# Altium project iso_simucam.PrjPCB (part 1 of 2)
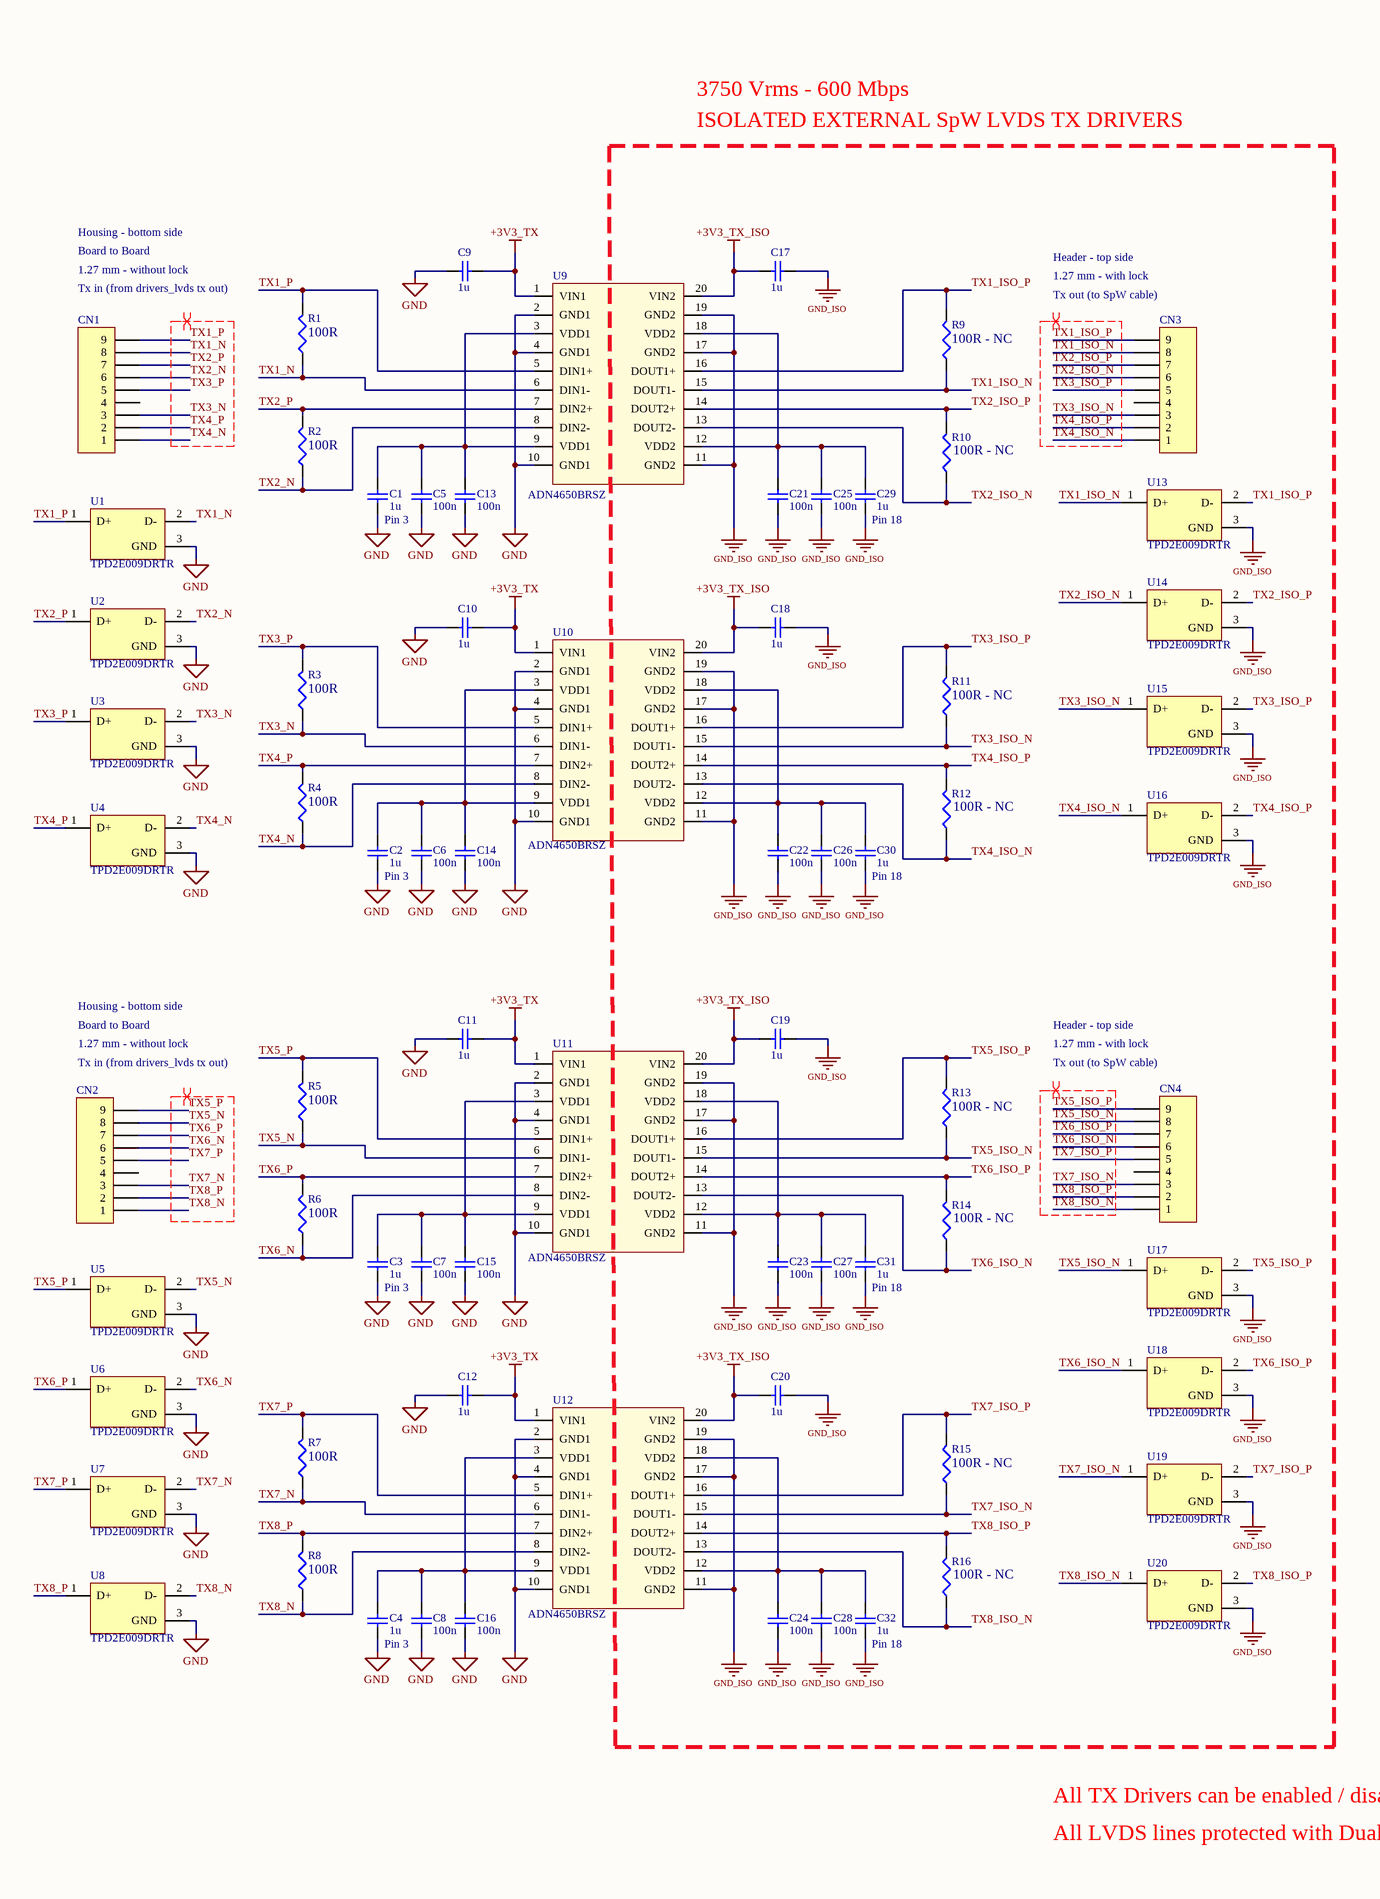
[diagram p0: iso_lvds_tx.SchDoc, left]
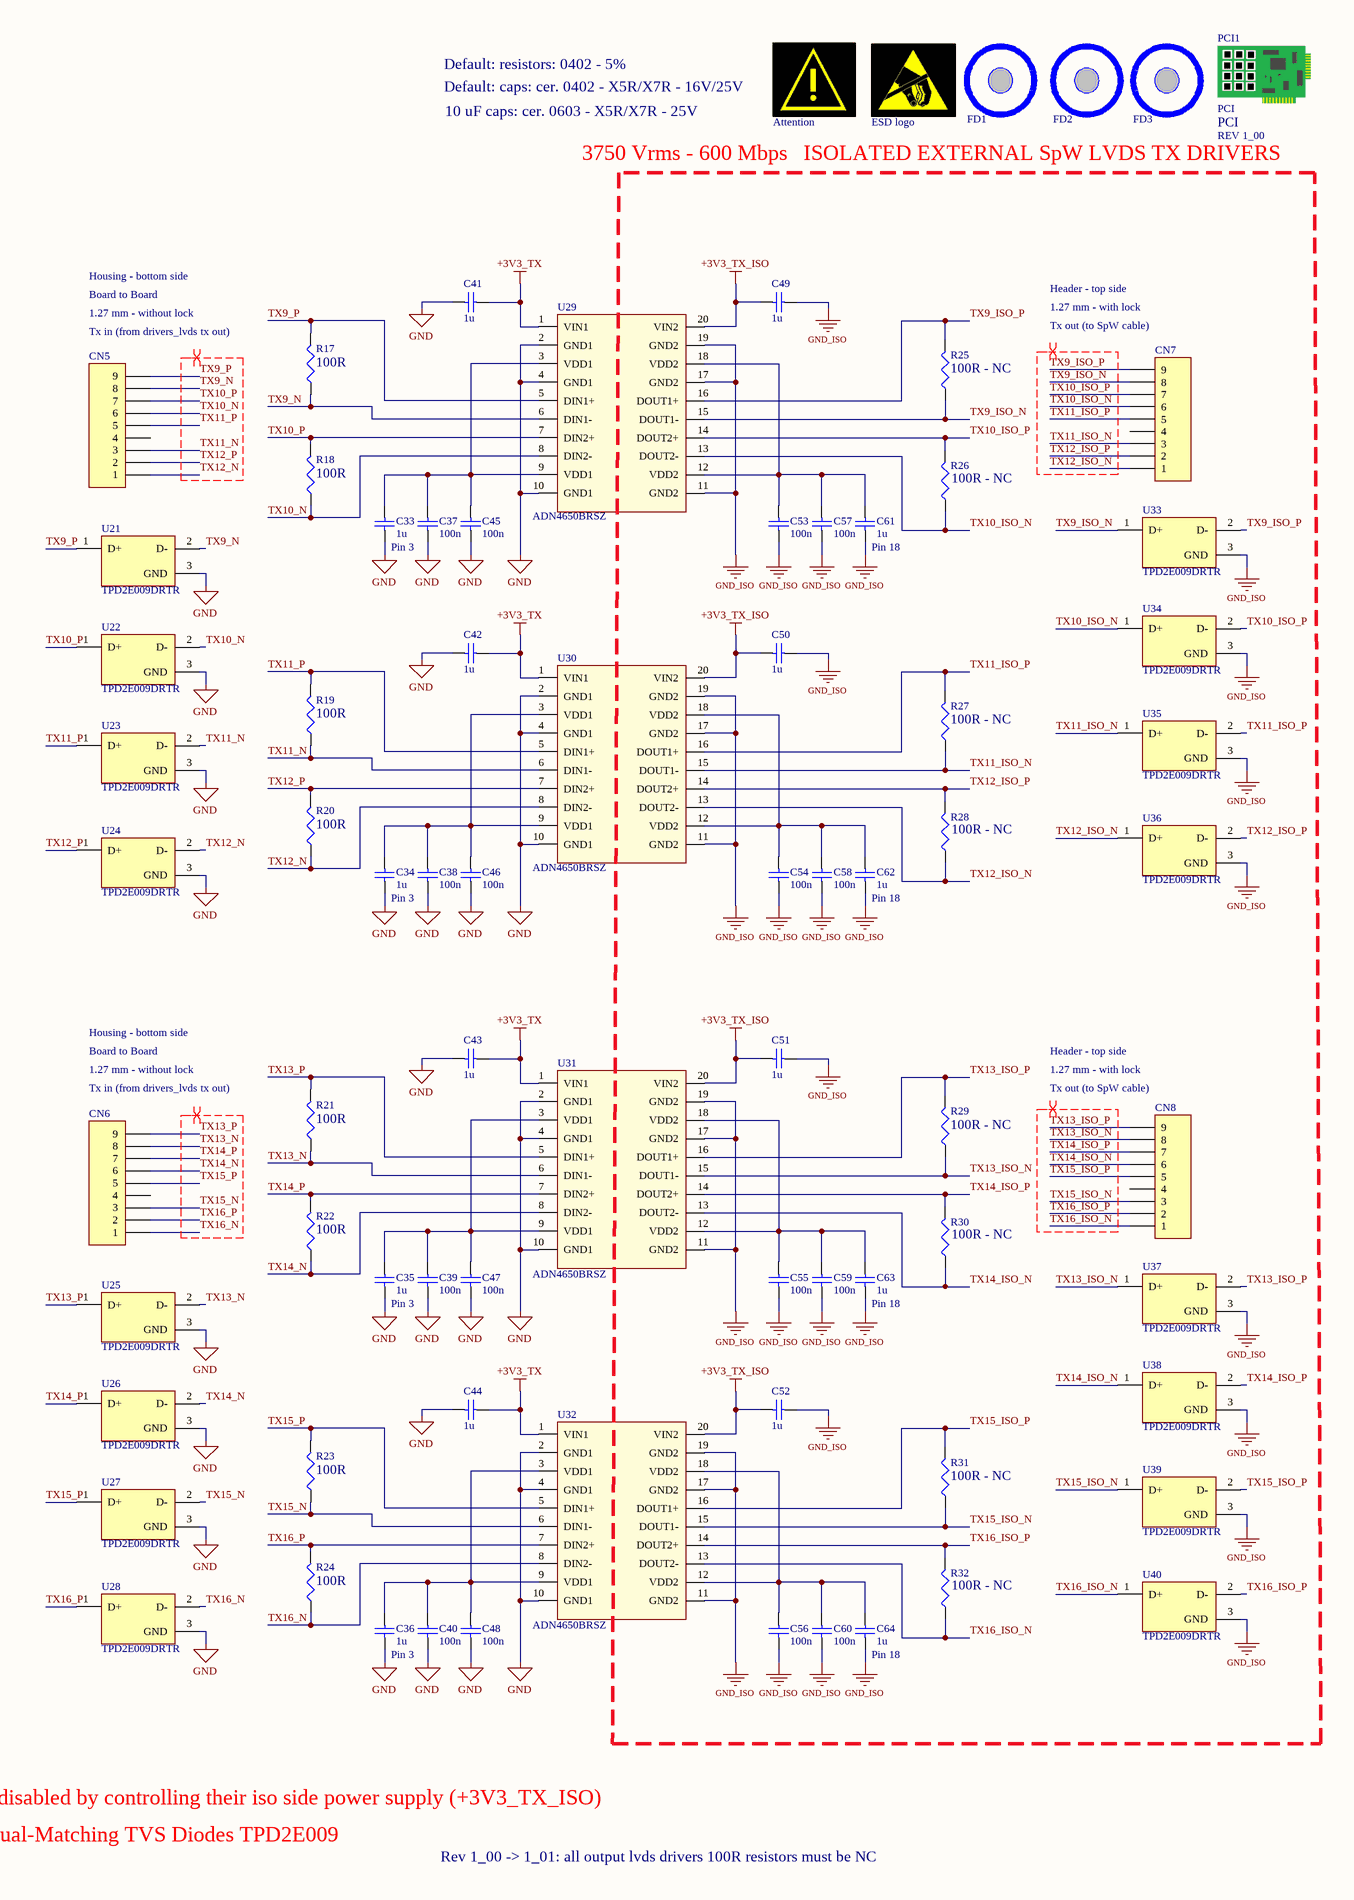
[diagram p1: iso_lvds_tx.SchDoc, right]
4 sheets, 383 parts. Net scope: flat (ports and power ports of the same name join across sheets).
Board file: iso_simucam.PcbDoc
Sheets:
  iso_lvds_tx.SchDoc
  iso_lvds_rx.SchDoc
  iso_sincs.SchDoc
  iso_power.SchDoc

## Sheet iso_lvds_tx.SchDoc: Tx iso drivers
size A2; Author: Cassio Berni; DrawnBy: CCB; Revision: 1_01; SheetNumber: 1; SheetTotal: 4; PageSetup: Record=PageOptions|CenterHorizontal=True|CenterVertical=True|PrintScale=0.50|XCorrection=1.00|YCorrection=1.00|PrintKind=0|BorderSize=5000000|LeftOffset=0|BottomOffset=0|Orientation=2|PaperLength=1000|PaperWidth=1000|Scale=100|PaperSource=7|PrintQuality=-3|MediaType=1|DitherType=10|PrintScaleMode=1|PaperKind=A4|PaperIndex=9

### Parts
AT1  Valor: Attention  [LEIA_DOCUMENTACAO]  (hidden comment: ##nl)
C1  Valor: 1u  [0402-cap]  (hidden comment: Capacitor Cerâmico SMD)
C2  Valor: 1u  [0402-cap]  (hidden comment: Capacitor Cerâmico SMD)
C3  Valor: 1u  [0402-cap]  (hidden comment: Capacitor Cerâmico SMD)
C4  Valor: 1u  [0402-cap]  (hidden comment: Capacitor Cerâmico SMD)
C5  Valor: 100n  [0402-cap]  (hidden comment: Capacitor Cerâmico SMD)
C6  Valor: 100n  [0402-cap]  (hidden comment: Capacitor Cerâmico SMD)
C7  Valor: 100n  [0402-cap]  (hidden comment: Capacitor Cerâmico SMD)
C8  Valor: 100n  [0402-cap]  (hidden comment: Capacitor Cerâmico SMD)
C9  Valor: 1u  [0402-cap]  (hidden comment: Capacitor Cerâmico SMD)
C10  Valor: 1u  [0402-cap]  (hidden comment: Capacitor Cerâmico SMD)
C11  Valor: 1u  [0402-cap]  (hidden comment: Capacitor Cerâmico SMD)
C12  Valor: 1u  [0402-cap]  (hidden comment: Capacitor Cerâmico SMD)
C13  Valor: 100n  [0402-cap]  (hidden comment: Capacitor Cerâmico SMD)
C14  Valor: 100n  [0402-cap]  (hidden comment: Capacitor Cerâmico SMD)
C15  Valor: 100n  [0402-cap]  (hidden comment: Capacitor Cerâmico SMD)
C16  Valor: 100n  [0402-cap]  (hidden comment: Capacitor Cerâmico SMD)
C17  Valor: 1u  [0402-cap]  (hidden comment: Capacitor Cerâmico SMD)
C18  Valor: 1u  [0402-cap]  (hidden comment: Capacitor Cerâmico SMD)
C19  Valor: 1u  [0402-cap]  (hidden comment: Capacitor Cerâmico SMD)
C20  Valor: 1u  [0402-cap]  (hidden comment: Capacitor Cerâmico SMD)
C21  Valor: 100n  [0402-cap]  (hidden comment: Capacitor Cerâmico SMD)
C22  Valor: 100n  [0402-cap]  (hidden comment: Capacitor Cerâmico SMD)
C23  Valor: 100n  [0402-cap]  (hidden comment: Capacitor Cerâmico SMD)
C24  Valor: 100n  [0402-cap]  (hidden comment: Capacitor Cerâmico SMD)
C25  Valor: 100n  [0402-cap]  (hidden comment: Capacitor Cerâmico SMD)
C26  Valor: 100n  [0402-cap]  (hidden comment: Capacitor Cerâmico SMD)
C27  Valor: 100n  [0402-cap]  (hidden comment: Capacitor Cerâmico SMD)
C28  Valor: 100n  [0402-cap]  (hidden comment: Capacitor Cerâmico SMD)
C29  Valor: 1u  [0402-cap]  (hidden comment: Capacitor Cerâmico SMD)
C30  Valor: 1u  [0402-cap]  (hidden comment: Capacitor Cerâmico SMD)
C31  Valor: 1u  [0402-cap]  (hidden comment: Capacitor Cerâmico SMD)
C32  Valor: 1u  [0402-cap]  (hidden comment: Capacitor Cerâmico SMD)
C33  Valor: 1u  [0402-cap]  (hidden comment: Capacitor Cerâmico SMD)
C34  Valor: 1u  [0402-cap]  (hidden comment: Capacitor Cerâmico SMD)
C35  Valor: 1u  [0402-cap]  (hidden comment: Capacitor Cerâmico SMD)
C36  Valor: 1u  [0402-cap]  (hidden comment: Capacitor Cerâmico SMD)
C37  Valor: 100n  [0402-cap]  (hidden comment: Capacitor Cerâmico SMD)
C38  Valor: 100n  [0402-cap]  (hidden comment: Capacitor Cerâmico SMD)
C39  Valor: 100n  [0402-cap]  (hidden comment: Capacitor Cerâmico SMD)
C40  Valor: 100n  [0402-cap]  (hidden comment: Capacitor Cerâmico SMD)
C41  Valor: 1u  [0402-cap]  (hidden comment: Capacitor Cerâmico SMD)
C42  Valor: 1u  [0402-cap]  (hidden comment: Capacitor Cerâmico SMD)
C43  Valor: 1u  [0402-cap]  (hidden comment: Capacitor Cerâmico SMD)
C44  Valor: 1u  [0402-cap]  (hidden comment: Capacitor Cerâmico SMD)
C45  Valor: 100n  [0402-cap]  (hidden comment: Capacitor Cerâmico SMD)
C46  Valor: 100n  [0402-cap]  (hidden comment: Capacitor Cerâmico SMD)
C47  Valor: 100n  [0402-cap]  (hidden comment: Capacitor Cerâmico SMD)
C48  Valor: 100n  [0402-cap]  (hidden comment: Capacitor Cerâmico SMD)
C49  Valor: 1u  [0402-cap]  (hidden comment: Capacitor Cerâmico SMD)
C50  Valor: 1u  [0402-cap]  (hidden comment: Capacitor Cerâmico SMD)
C51  Valor: 1u  [0402-cap]  (hidden comment: Capacitor Cerâmico SMD)
C52  Valor: 1u  [0402-cap]  (hidden comment: Capacitor Cerâmico SMD)
C53  Valor: 100n  [0402-cap]  (hidden comment: Capacitor Cerâmico SMD)
C54  Valor: 100n  [0402-cap]  (hidden comment: Capacitor Cerâmico SMD)
C55  Valor: 100n  [0402-cap]  (hidden comment: Capacitor Cerâmico SMD)
C56  Valor: 100n  [0402-cap]  (hidden comment: Capacitor Cerâmico SMD)
C57  Valor: 100n  [0402-cap]  (hidden comment: Capacitor Cerâmico SMD)
C58  Valor: 100n  [0402-cap]  (hidden comment: Capacitor Cerâmico SMD)
C59  Valor: 100n  [0402-cap]  (hidden comment: Capacitor Cerâmico SMD)
C60  Valor: 100n  [0402-cap]  (hidden comment: Capacitor Cerâmico SMD)
C61  Valor: 1u  [0402-cap]  (hidden comment: Capacitor Cerâmico SMD)
C62  Valor: 1u  [0402-cap]  (hidden comment: Capacitor Cerâmico SMD)
C63  Valor: 1u  [0402-cap]  (hidden comment: Capacitor Cerâmico SMD)
C64  Valor: 1u  [0402-cap]  (hidden comment: Capacitor Cerâmico SMD)
CN1  MHDR1X9  [MHDR1X9_Axonn]  (value not drawn)
CN2  MHDR1X9  [MHDR1X9_Axonn]  (value not drawn)
CN3  MHDR1X9  [MHDR1X9_Axonn]  (value not drawn)
CN4  MHDR1X9  [MHDR1X9_Axonn]  (value not drawn)
CN5  MHDR1X9  [MHDR1X9_Axonn]  (value not drawn)
CN6  MHDR1X9  [MHDR1X9_Axonn]  (value not drawn)
CN7  MHDR1X9  [MHDR1X9_Axonn]  (value not drawn)
CN8  MHDR1X9  [MHDR1X9_Axonn]  (value not drawn)
ESD1  Valor: ESD logo  [ESTATICA]  (hidden comment: ##nl)
FD1  ##nl  [FIDUCIAL]  (value not drawn)
FD2  ##nl  [FIDUCIAL]  (value not drawn)
FD3  ##nl  [FIDUCIAL]  (value not drawn)
PCI1  PCI  Rev: REV 1_00
R1  Valor: 100R  [0402-res]  (hidden comment: Res3)
R2  Valor: 100R  [0402-res]  (hidden comment: Res3)
R3  Valor: 100R  [0402-res]  (hidden comment: Res3)
R4  Valor: 100R  [0402-res]  (hidden comment: Res3)
R5  Valor: 100R  [0402-res]  (hidden comment: Res3)
R6  Valor: 100R  [0402-res]  (hidden comment: Res3)
R7  Valor: 100R  [0402-res]  (hidden comment: Res3)
R8  Valor: 100R  [0402-res]  (hidden comment: Res3)
R9  Valor: 100R - NC  [0402-res]  (hidden comment: Res3)
R10  Valor: 100R - NC  [0402-res]  (hidden comment: Res3)
R11  Valor: 100R - NC  [0402-res]  (hidden comment: Res3)
R12  Valor: 100R - NC  [0402-res]  (hidden comment: Res3)
R13  Valor: 100R - NC  [0402-res]  (hidden comment: Res3)
R14  Valor: 100R - NC  [0402-res]  (hidden comment: Res3)
R15  Valor: 100R - NC  [0402-res]  (hidden comment: Res3)
R16  Valor: 100R - NC  [0402-res]  (hidden comment: Res3)
R17  Valor: 100R  [0402-res]  (hidden comment: Res3)
R18  Valor: 100R  [0402-res]  (hidden comment: Res3)
R19  Valor: 100R  [0402-res]  (hidden comment: Res3)
R20  Valor: 100R  [0402-res]  (hidden comment: Res3)
R21  Valor: 100R  [0402-res]  (hidden comment: Res3)
R22  Valor: 100R  [0402-res]  (hidden comment: Res3)
R23  Valor: 100R  [0402-res]  (hidden comment: Res3)
R24  Valor: 100R  [0402-res]  (hidden comment: Res3)
R25  Valor: 100R - NC  [0402-res]  (hidden comment: Res3)
R26  Valor: 100R - NC  [0402-res]  (hidden comment: Res3)
R27  Valor: 100R - NC  [0402-res]  (hidden comment: Res3)
R28  Valor: 100R - NC  [0402-res]  (hidden comment: Res3)
R29  Valor: 100R - NC  [0402-res]  (hidden comment: Res3)
R30  Valor: 100R - NC  [0402-res]  (hidden comment: Res3)
R31  Valor: 100R - NC  [0402-res]  (hidden comment: Res3)
R32  Valor: 100R - NC  [0402-res]  (hidden comment: Res3)
U1  TPD2E009DRTR  [DRT3]
U2  TPD2E009DRTR  [DRT3]
U3  TPD2E009DRTR  [DRT3]
U4  TPD2E009DRTR  [DRT3]
U5  TPD2E009DRTR  [DRT3]
U6  TPD2E009DRTR  [DRT3]
U7  TPD2E009DRTR  [DRT3]
U8  TPD2E009DRTR  [DRT3]
U9  ADN4650BRSZ  [SSOP-RS-20]
U10  ADN4650BRSZ  [SSOP-RS-20]
U11  ADN4650BRSZ  [SSOP-RS-20]
U12  ADN4650BRSZ  [SSOP-RS-20]
U13  TPD2E009DRTR  [DRT3]
U14  TPD2E009DRTR  [DRT3]
U15  TPD2E009DRTR  [DRT3]
U16  TPD2E009DRTR  [DRT3]
U17  TPD2E009DRTR  [DRT3]
U18  TPD2E009DRTR  [DRT3]
U19  TPD2E009DRTR  [DRT3]
U20  TPD2E009DRTR  [DRT3]
U21  TPD2E009DRTR  [DRT3]
U22  TPD2E009DRTR  [DRT3]
U23  TPD2E009DRTR  [DRT3]
U24  TPD2E009DRTR  [DRT3]
U25  TPD2E009DRTR  [DRT3]
U26  TPD2E009DRTR  [DRT3]
U27  TPD2E009DRTR  [DRT3]
U28  TPD2E009DRTR  [DRT3]
U29  ADN4650BRSZ  [SSOP-RS-20]
U30  ADN4650BRSZ  [SSOP-RS-20]
U31  ADN4650BRSZ  [SSOP-RS-20]
U32  ADN4650BRSZ  [SSOP-RS-20]
U33  TPD2E009DRTR  [DRT3]
U34  TPD2E009DRTR  [DRT3]
U35  TPD2E009DRTR  [DRT3]
U36  TPD2E009DRTR  [DRT3]
U37  TPD2E009DRTR  [DRT3]
U38  TPD2E009DRTR  [DRT3]
U39  TPD2E009DRTR  [DRT3]
U40  TPD2E009DRTR  [DRT3]

### Blocks framed on the sheet
ISOLATED EXTERNAL SpW LVDS TX DRIVERS: C17-C32 CN3 CN4 R9-R16 U9-U20
ISOLATED EXTERNAL SpW LVDS TX DRIVERS: C49-C64 CN7 CN8 R25-R32 U29-U40

### Nets
+3V3_TX: C9.1 C10.1 C11.1 C12.1 C41.1 C42.1 C43.1 C44.1 U9.1(VIN1) U10.1(VIN1) U11.1(VIN1) U12.1(VIN1) U29.1(VIN1) U30.1(VIN1) U31.1(VIN1) U32.1(VIN1)
+3V3_TX_ISO: C17.2 C18.2 C19.2 C20.2 C49.2 C50.2 C51.2 C52.2 U9.20(VIN2) U10.20(VIN2) U11.20(VIN2) U12.20(VIN2) U29.20(VIN2) U30.20(VIN2) U31.20(VIN2) U32.20(VIN2)
GND: C1.1 C2.1 C3.1 C4.1 C5.1 C6.1 C7.1 C8.1 C9.2 C10.2 C11.2 C12.2 C13.1 C14.1 C15.1 C16.1 C33.1 C34.1 C35.1 C36.1 C37.1 C38.1 C39.1 C40.1 C41.2 C42.2 C43.2 C44.2 C45.1 C46.1 C47.1 C48.1 U1.3(GND) U2.3(GND) U3.3(GND) U4.3(GND) U5.3(GND) U6.3(GND) U7.3(GND) U8.3(GND) U9.2(GND1) U9.4(GND1) U9.10(GND1) U10.2(GND1) U10.4(GND1) U10.10(GND1) U11.2(GND1) U11.4(GND1) U11.10(GND1) U12.2(GND1) U12.4(GND1) U12.10(GND1) U21.3(GND) U22.3(GND) U23.3(GND) U24.3(GND) U25.3(GND) U26.3(GND) U27.3(GND) U28.3(GND) U29.2(GND1) U29.4(GND1) U29.10(GND1) U30.2(GND1) U30.4(GND1) U30.10(GND1) U31.2(GND1) U31.4(GND1) U31.10(GND1) U32.2(GND1) U32.4(GND1) U32.10(GND1)
GND_ISO: C17.1 C18.1 C19.1 C20.1 C21.1 C22.1 C23.1 C24.1 C25.1 C26.1 C27.1 C28.1 C29.1 C30.1 C31.1 C32.1 C49.1 C50.1 C51.1 C52.1 C53.1 C54.1 C55.1 C56.1 C57.1 C58.1 C59.1 C60.1 C61.1 C62.1 C63.1 C64.1 U9.11(GND2) U9.17(GND2) U9.19(GND2) U10.11(GND2) U10.17(GND2) U10.19(GND2) U11.11(GND2) U11.17(GND2) U11.19(GND2) U12.11(GND2) U12.17(GND2) U12.19(GND2) U13.3(GND) U14.3(GND) U15.3(GND) U16.3(GND) U17.3(GND) U18.3(GND) U19.3(GND) U20.3(GND) U29.11(GND2) U29.17(GND2) U29.19(GND2) U30.11(GND2) U30.17(GND2) U30.19(GND2) U31.11(GND2) U31.17(GND2) U31.19(GND2) U32.11(GND2) U32.17(GND2) U32.19(GND2) U33.3(GND) U34.3(GND) U35.3(GND) U36.3(GND) U37.3(GND) U38.3(GND) U39.3(GND) U40.3(GND)
TX1_ISO_N: CN3.8 R9.1 U9.15(DOUT1-) U13.1(D+)
TX1_ISO_P: CN3.9 R9.2 U9.16(DOUT1+) U13.2(D-)
TX1_N: CN1.8 R1.1 U1.2(D-) U9.6(DIN1-)
TX1_P: CN1.9 R1.2 U1.1(D+) U9.5(DIN1+)
TX2_ISO_N: CN3.6 R10.1 U9.13(DOUT2-) U14.1(D+)
TX2_ISO_P: CN3.7 R10.2 U9.14(DOUT2+) U14.2(D-)
TX2_N: CN1.6 R2.1 U2.2(D-) U9.8(DIN2-)
TX2_P: CN1.7 R2.2 U2.1(D+) U9.7(DIN2+)
TX3_ISO_N: CN3.3 R11.1 U10.15(DOUT1-) U15.1(D+)
TX3_ISO_P: CN3.5 R11.2 U10.16(DOUT1+) U15.2(D-)
TX3_N: CN1.3 R3.1 U3.2(D-) U10.6(DIN1-)
TX3_P: CN1.5 R3.2 U3.1(D+) U10.5(DIN1+)
TX4_ISO_N: CN3.1 R12.1 U10.13(DOUT2-) U16.1(D+)
TX4_ISO_P: CN3.2 R12.2 U10.14(DOUT2+) U16.2(D-)
TX4_N: CN1.1 R4.1 U4.2(D-) U10.8(DIN2-)
TX4_P: CN1.2 R4.2 U4.1(D+) U10.7(DIN2+)
TX5_ISO_N: CN4.8 R13.1 U11.15(DOUT1-) U17.1(D+)
TX5_ISO_P: CN4.9 R13.2 U11.16(DOUT1+) U17.2(D-)
TX5_N: CN2.8 R5.1 U5.2(D-) U11.6(DIN1-)
TX5_P: CN2.9 R5.2 U5.1(D+) U11.5(DIN1+)
TX6_ISO_N: CN4.6 R14.1 U11.13(DOUT2-) U18.1(D+)
TX6_ISO_P: CN4.7 R14.2 U11.14(DOUT2+) U18.2(D-)
TX6_N: CN2.6 R6.1 U6.2(D-) U11.8(DIN2-)
TX6_P: CN2.7 R6.2 U6.1(D+) U11.7(DIN2+)
TX7_ISO_N: CN4.3 R15.1 U12.15(DOUT1-) U19.1(D+)
TX7_ISO_P: CN4.5 R15.2 U12.16(DOUT1+) U19.2(D-)
TX7_N: CN2.3 R7.1 U7.2(D-) U12.6(DIN1-)
TX7_P: CN2.5 R7.2 U7.1(D+) U12.5(DIN1+)
TX8_ISO_N: CN4.1 R16.1 U12.13(DOUT2-) U20.1(D+)
TX8_ISO_P: CN4.2 R16.2 U12.14(DOUT2+) U20.2(D-)
TX8_N: CN2.1 R8.1 U8.2(D-) U12.8(DIN2-)
TX8_P: CN2.2 R8.2 U8.1(D+) U12.7(DIN2+)
TX9_ISO_N: CN7.8 R25.1 U29.15(DOUT1-) U33.1(D+)
TX9_ISO_P: CN7.9 R25.2 U29.16(DOUT1+) U33.2(D-)
TX9_N: CN5.8 R17.1 U21.2(D-) U29.6(DIN1-)
TX9_P: CN5.9 R17.2 U21.1(D+) U29.5(DIN1+)
TX10_ISO_N: CN7.6 R26.1 U29.13(DOUT2-) U34.1(D+)
TX10_ISO_P: CN7.7 R26.2 U29.14(DOUT2+) U34.2(D-)
TX10_N: CN5.6 R18.1 U22.2(D-) U29.8(DIN2-)
TX10_P: CN5.7 R18.2 U22.1(D+) U29.7(DIN2+)
TX11_ISO_N: CN7.3 R27.1 U30.15(DOUT1-) U35.1(D+)
TX11_ISO_P: CN7.5 R27.2 U30.16(DOUT1+) U35.2(D-)
TX11_N: CN5.3 R19.1 U23.2(D-) U30.6(DIN1-)
TX11_P: CN5.5 R19.2 U23.1(D+) U30.5(DIN1+)
TX12_ISO_N: CN7.1 R28.1 U30.13(DOUT2-) U36.1(D+)
TX12_ISO_P: CN7.2 R28.2 U30.14(DOUT2+) U36.2(D-)
TX12_N: CN5.1 R20.1 U24.2(D-) U30.8(DIN2-)
TX12_P: CN5.2 R20.2 U24.1(D+) U30.7(DIN2+)
TX13_ISO_N: CN8.8 R29.1 U31.15(DOUT1-) U37.1(D+)
TX13_ISO_P: CN8.9 R29.2 U31.16(DOUT1+) U37.2(D-)
TX13_N: CN6.8 R21.1 U25.2(D-) U31.6(DIN1-)
TX13_P: CN6.9 R21.2 U25.1(D+) U31.5(DIN1+)
TX14_ISO_N: CN8.6 R30.1 U31.13(DOUT2-) U38.1(D+)
TX14_ISO_P: CN8.7 R30.2 U31.14(DOUT2+) U38.2(D-)
TX14_N: CN6.6 R22.1 U26.2(D-) U31.8(DIN2-)
TX14_P: CN6.7 R22.2 U26.1(D+) U31.7(DIN2+)
TX15_ISO_N: CN8.3 R31.1 U32.15(DOUT1-) U39.1(D+)
TX15_ISO_P: CN8.5 R31.2 U32.16(DOUT1+) U39.2(D-)
TX15_N: CN6.3 R23.1 U27.2(D-) U32.6(DIN1-)
TX15_P: CN6.5 R23.2 U27.1(D+) U32.5(DIN1+)
TX16_ISO_N: CN8.1 R32.1 U32.13(DOUT2-) U40.1(D+)
TX16_ISO_P: CN8.2 R32.2 U32.14(DOUT2+) U40.2(D-)
TX16_N: CN6.1 R24.1 U28.2(D-) U32.8(DIN2-)
TX16_P: CN6.2 R24.2 U28.1(D+) U32.7(DIN2+)
NetC1_2: C1.2 C5.2 C13.2 U9.3(VDD1) U9.9(VDD1)
NetC2_2: C2.2 C6.2 C14.2 U10.3(VDD1) U10.9(VDD1)
NetC3_2: C3.2 C7.2 C15.2 U11.3(VDD1) U11.9(VDD1)
NetC4_2: C4.2 C8.2 C16.2 U12.3(VDD1) U12.9(VDD1)
NetC21_2: C21.2 C25.2 C29.2 U9.12(VDD2) U9.18(VDD2)
NetC22_2: C22.2 C26.2 C30.2 U10.12(VDD2) U10.18(VDD2)
NetC23_2: C23.2 C27.2 C31.2 U11.12(VDD2) U11.18(VDD2)
NetC24_2: C24.2 C28.2 C32.2 U12.12(VDD2) U12.18(VDD2)
NetC33_2: C33.2 C37.2 C45.2 U29.3(VDD1) U29.9(VDD1)
NetC34_2: C34.2 C38.2 C46.2 U30.3(VDD1) U30.9(VDD1)
NetC35_2: C35.2 C39.2 C47.2 U31.3(VDD1) U31.9(VDD1)
NetC36_2: C36.2 C40.2 C48.2 U32.3(VDD1) U32.9(VDD1)
NetC53_2: C53.2 C57.2 C61.2 U29.12(VDD2) U29.18(VDD2)
NetC54_2: C54.2 C58.2 C62.2 U30.12(VDD2) U30.18(VDD2)
NetC55_2: C55.2 C59.2 C63.2 U31.12(VDD2) U31.18(VDD2)
NetC56_2: C56.2 C60.2 C64.2 U32.12(VDD2) U32.18(VDD2)

Not connected (* = marked no-connect by the designer): CN1 4; CN2 4; CN3 4; CN4 4; CN5 4; CN6 4; CN7 4; CN8 4

### Layout directives
differential pair; net class TX1_TX4; rule Differential Pairs Routing [Pref Gap = 10mil    Min Gap  = 10mil    Max Gap  = 10milPref Width = 10mil    Min Width  = 10mil    Max Width  = 10mil]: TX1_N, TX1_P, TX2_N, TX2_P, TX3_N, TX3_P, TX4_N, TX4_P
differential pair; net class TX5_TX8; rule Differential Pairs Routing [Pref Gap = 10mil    Min Gap  = 10mil    Max Gap  = 10milPref Width = 10mil    Min Width  = 10mil    Max Width  = 10mil]: TX5_N, TX5_P, TX6_N, TX6_P, TX7_N, TX7_P, TX8_N, TX8_P
differential pair; net class TX1_TX4_ISO; rule Differential Pairs Routing [Pref Gap = 10mil    Min Gap  = 10mil    Max Gap  = 10milPref Width = 10mil    Min Width  = 10mil    Max Width  = 10mil]: TX1_ISO_N, TX1_ISO_P, TX2_ISO_N, TX2_ISO_P, TX3_ISO_N, TX3_ISO_P, TX4_ISO_N, TX4_ISO_P
differential pair; net class TX5_TX8_ISO; rule Differential Pairs Routing [Pref Gap = 10mil    Min Gap  = 10mil    Max Gap  = 10milPref Width = 10mil    Min Width  = 10mil    Max Width  = 10mil]: TX5_ISO_N, TX5_ISO_P, TX6_ISO_N, TX6_ISO_P, TX7_ISO_N, TX7_ISO_P, TX8_ISO_N, TX8_ISO_P
differential pair; net class TX9_TX12; rule Differential Pairs Routing [Pref Gap = 10mil    Min Gap  = 10mil    Max Gap  = 10milPref Width = 10mil    Min Width  = 10mil    Max Width  = 10mil]: TX9_N, TX9_P, TX10_N, TX10_P, TX11_N, TX11_P, TX12_N, TX12_P
differential pair; net class TX13_TX16; rule Differential Pairs Routing [Pref Gap = 10mil    Min Gap  = 10mil    Max Gap  = 10milPref Width = 10mil    Min Width  = 10mil    Max Width  = 10mil]: TX13_ISO_N, TX13_ISO_P, TX13_N, TX13_P, TX14_ISO_N, TX14_ISO_P, TX14_N, TX14_P, TX15_ISO_N, TX15_ISO_P, TX15_N, TX15_P, TX16_ISO_N, TX16_ISO_P, TX16_N, TX16_P
differential pair; net class TX9_TX12_ISO; rule Differential Pairs Routing [Pref Gap = 10mil    Min Gap  = 10mil    Max Gap  = 10milPref Width = 10mil    Min Width  = 10mil    Max Width  = 10mil]: TX9_ISO_N, TX9_ISO_P, TX10_ISO_N, TX10_ISO_P, TX11_ISO_N, TX11_ISO_P, TX12_ISO_N, TX12_ISO_P

### Notes on the sheet
- Default: resistors: 0402 - 5%
- (near AT1) Default: caps: cer. 0402 - X5R/X7R - 16V/25V
- 3750 Vrms - 600 Mbps
- 10 uF caps: cer. 0603 - X5R/X7R - 25V
- Housing - bottom side
- Board to Board
- 1.27 mm - without lock
- Tx in (from drivers_lvds tx out)
- Header - top side
- 1.27 mm - with lock
- (near CN3) Tx out (to SpW cable)
- (near CN7) Tx out (to SpW cable)
- Pin 3
- (near C29) Pin 18
- (near C61) Pin 18
- (near C30) Pin 18
- (near C62) Pin 18
- (near CN4) Tx out (to SpW cable)
- (near CN8) Tx out (to SpW cable)
- (near C31) Pin 18
- (near C63) Pin 18
- (near C32) Pin 18
- (near C64) Pin 18
- All TX Drivers can be enabled / disabled by controlling their iso side power supply (+3V3_TX_ISO)
- All LVDS lines protected with Dual-Matching TVS Diodes TPD2E009
- Rev 1_00 -> 1_01: all output lvds drivers 100R resistors must be NC

### Library data of the parts
AT1 = ATENCAO
CN1-CN8 = MHDR1X9: Header, 9-Pin; LatestRevisionDate: 17-Jul-2002; LatestRevisionNote: Re-released for DXP Platform.; Publisher: Altium Limited
ESD1 = ESD
FD1-FD3 = Fiducial: Valor: *
R1-R32 = Res3: Resistor; Grupo: 01
U1-U8 U13-U28 U33-U40 = TPD2E009DRTR: ESD Protection Array for High-Speed Data Interfaces, 2 Channels, -40 to +85 degC, 3-pin SOT (DRT), Green (RoHS & no Sb/Br); Manufacturer: Texas Instruments; Breakdown Voltage(Min)(V): 9; Differential Capacitance(pF): 0.01; IEC 61000-4-2 Air-Gap(+/- kV): 8; IO Capacitance(Typ)(pF): 0.7; IO Leakage Current(nA): 10; Serial ATA / eSATA: TRUE; SubFamily: ESD Solution; DatasheetVersion: SLVS953A; PackageVersion: revD, Jun-2008; PackageReference: DRT3; PackageDescription: 3-Flat Lead Plastic Small Outline, 1 x 1 mm (inc leads), 0.35 mm Pitch; Supplier 1: Digi-Key; Supplier Part Number 1: 296-25410-2-ND; Supplier 2: Digi-Key; Supplier Part Number 2: 296-25410-1-ND; Supplier 3: Digi-Key; Supplier Part Number 3: 296-25410-6-ND; Supplier 4: Newark; Supplier Part Number 4: 50R8093; Supplier 5: Mouser; Supplier Part Number 5: 595-TPD2E009DRTR; Eco-Plan: Green (RoHS & no Sb/Br); IEC 61000-4-2 Contact(+/- kV): 8; Mounting Technology: Surface Mount; PartNumber: TPD2E009DRTR; ComponentLink1Description: Datasheet; ComponentLink1URL: http://www.ti.com/general/docs/lit/getliterature.tsp?genericPartNumber=TPD2E009&fileType=pdf; ComponentLink2Description: URL Link1; ComponentLink2URL: SamplesURL:http://www.ti.com/product/tpd2e009#samples
U9-U12 U29-U32 = ADN4650BRSZ: 5 kV RMS/3.75 kV RMS, 600 Mbps,  Dual-Channel LVDS Isolators; Fabricante: Analog Devices; Grupo: 07; Encapsulamento: SSOP-20; Valor: *; Obs: *; Datasheet: *; Part Number: ADN4650BRSZ
PCI1 = PCI: Valor: PCI

## Sheet iso_lvds_rx.SchDoc: Rx iso drivers
size A2; Author: Cassio Berni; DrawnBy: CCB; Revision: 1_01; SheetNumber: 2; SheetTotal: 4; PageSetup: Record=PageOptions|CenterHorizontal=True|CenterVertical=True|PrintScale=0.50|XCorrection=1.00|YCorrection=1.00|PrintKind=0|BorderSize=5000000|LeftOffset=0|BottomOffset=0|Orientation=2|PaperLength=1000|PaperWidth=1000|Scale=100|PaperSource=7|PrintQuality=-3|MediaType=1|DitherType=10|PrintScaleMode=1|PaperKind=A4|PaperIndex=9
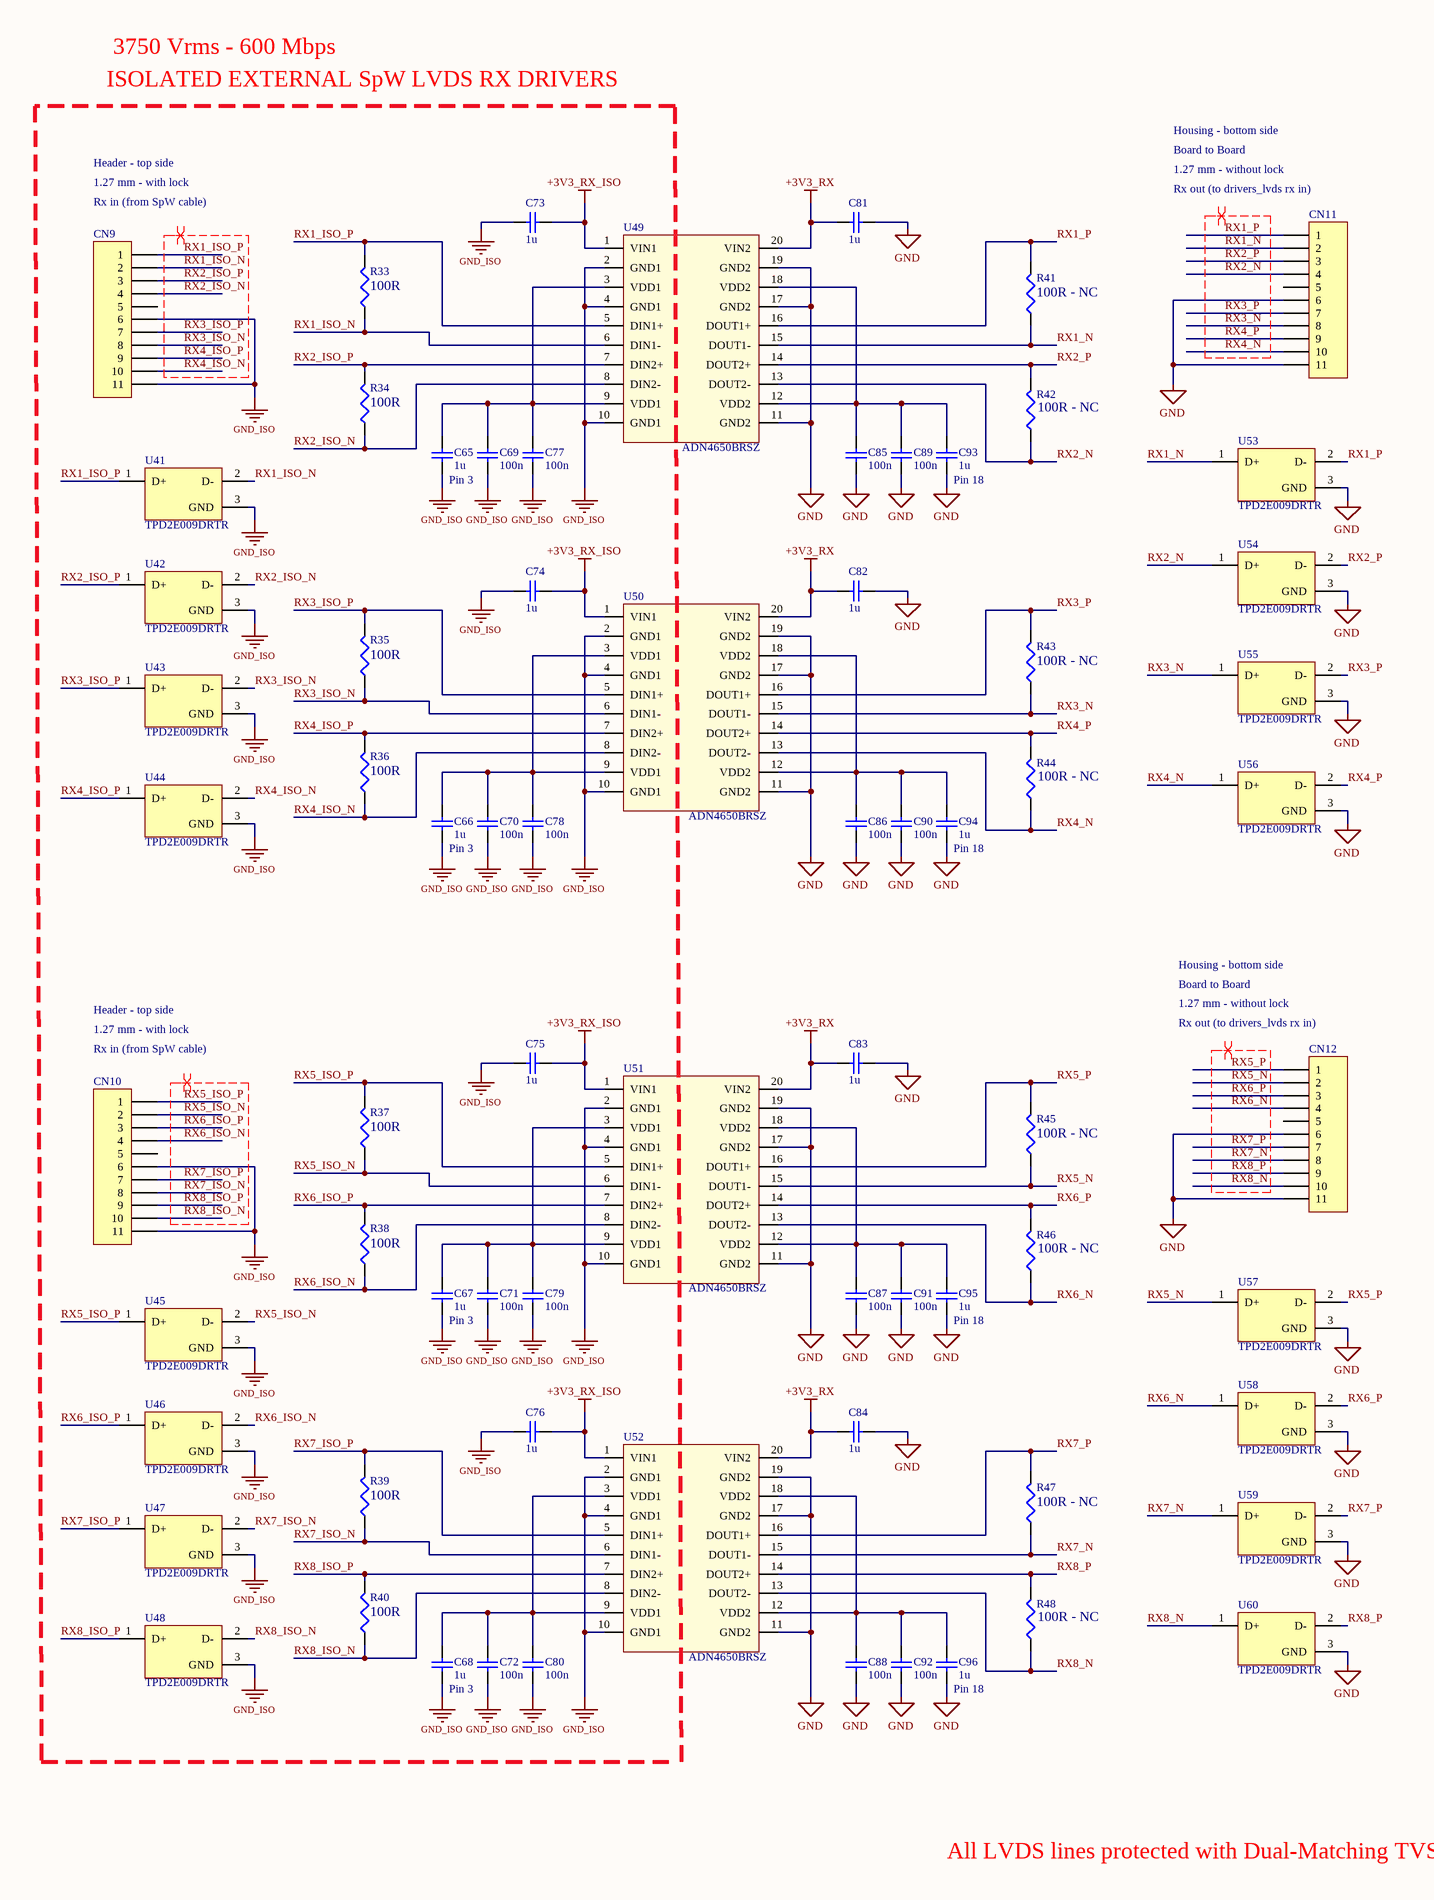
[diagram p2: iso_lvds_rx.SchDoc, left]
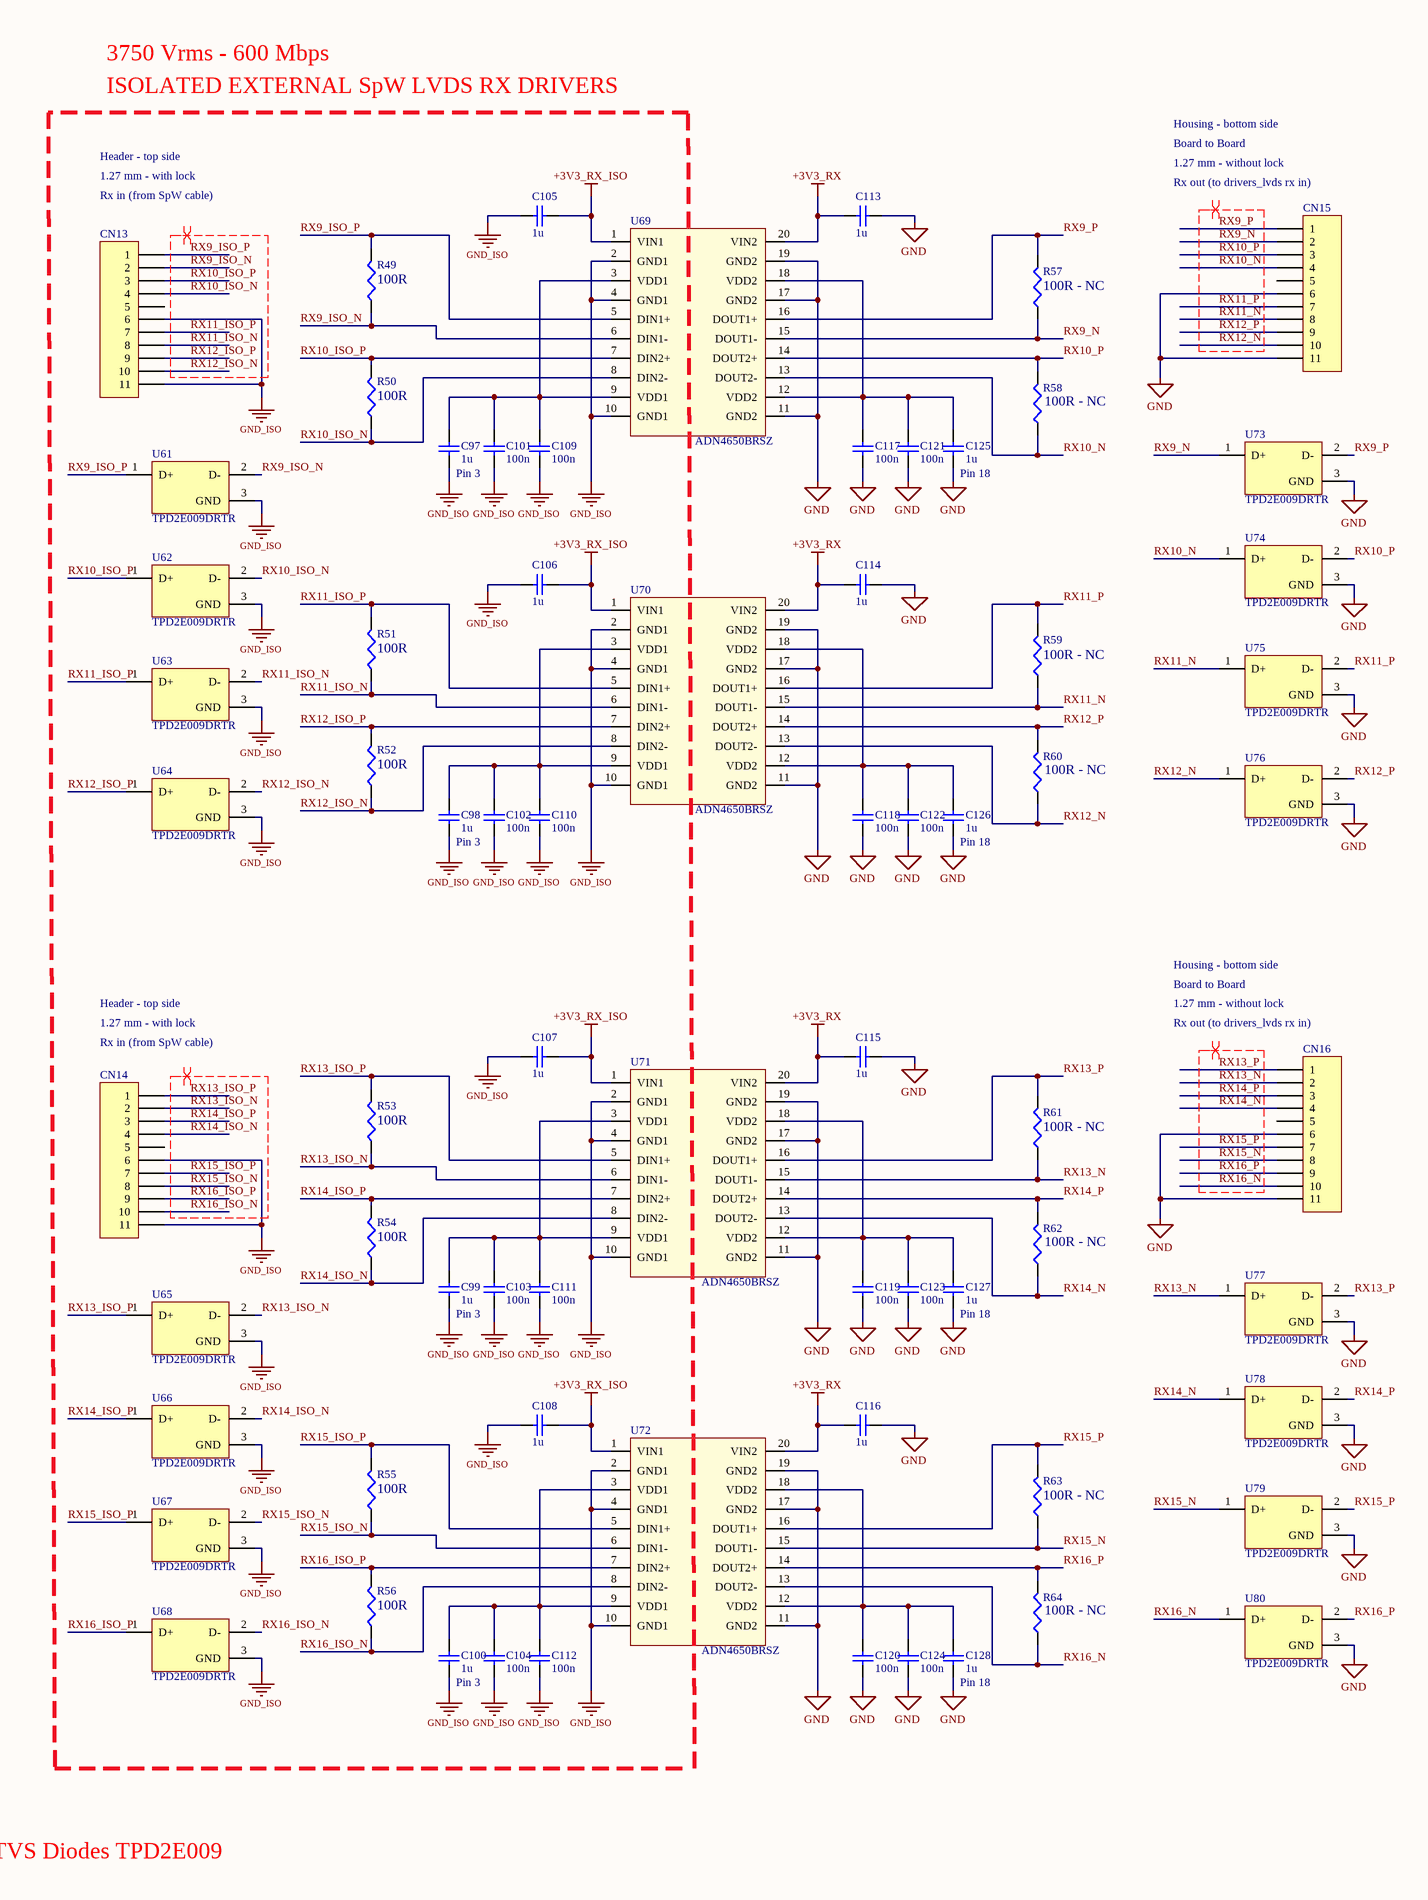
[diagram p3: iso_lvds_rx.SchDoc, right]

### Parts
C65  Valor: 1u  [0402-cap]  (hidden comment: Capacitor Cerâmico SMD)
C66  Valor: 1u  [0402-cap]  (hidden comment: Capacitor Cerâmico SMD)
C67  Valor: 1u  [0402-cap]  (hidden comment: Capacitor Cerâmico SMD)
C68  Valor: 1u  [0402-cap]  (hidden comment: Capacitor Cerâmico SMD)
C69  Valor: 100n  [0402-cap]  (hidden comment: Capacitor Cerâmico SMD)
C70  Valor: 100n  [0402-cap]  (hidden comment: Capacitor Cerâmico SMD)
C71  Valor: 100n  [0402-cap]  (hidden comment: Capacitor Cerâmico SMD)
C72  Valor: 100n  [0402-cap]  (hidden comment: Capacitor Cerâmico SMD)
C73  Valor: 1u  [0402-cap]  (hidden comment: Capacitor Cerâmico SMD)
C74  Valor: 1u  [0402-cap]  (hidden comment: Capacitor Cerâmico SMD)
C75  Valor: 1u  [0402-cap]  (hidden comment: Capacitor Cerâmico SMD)
C76  Valor: 1u  [0402-cap]  (hidden comment: Capacitor Cerâmico SMD)
C77  Valor: 100n  [0402-cap]  (hidden comment: Capacitor Cerâmico SMD)
C78  Valor: 100n  [0402-cap]  (hidden comment: Capacitor Cerâmico SMD)
C79  Valor: 100n  [0402-cap]  (hidden comment: Capacitor Cerâmico SMD)
C80  Valor: 100n  [0402-cap]  (hidden comment: Capacitor Cerâmico SMD)
C81  Valor: 1u  [0402-cap]  (hidden comment: Capacitor Cerâmico SMD)
C82  Valor: 1u  [0402-cap]  (hidden comment: Capacitor Cerâmico SMD)
C83  Valor: 1u  [0402-cap]  (hidden comment: Capacitor Cerâmico SMD)
C84  Valor: 1u  [0402-cap]  (hidden comment: Capacitor Cerâmico SMD)
C85  Valor: 100n  [0402-cap]  (hidden comment: Capacitor Cerâmico SMD)
C86  Valor: 100n  [0402-cap]  (hidden comment: Capacitor Cerâmico SMD)
C87  Valor: 100n  [0402-cap]  (hidden comment: Capacitor Cerâmico SMD)
C88  Valor: 100n  [0402-cap]  (hidden comment: Capacitor Cerâmico SMD)
C89  Valor: 100n  [0402-cap]  (hidden comment: Capacitor Cerâmico SMD)
C90  Valor: 100n  [0402-cap]  (hidden comment: Capacitor Cerâmico SMD)
C91  Valor: 100n  [0402-cap]  (hidden comment: Capacitor Cerâmico SMD)
C92  Valor: 100n  [0402-cap]  (hidden comment: Capacitor Cerâmico SMD)
C93  Valor: 1u  [0402-cap]  (hidden comment: Capacitor Cerâmico SMD)
C94  Valor: 1u  [0402-cap]  (hidden comment: Capacitor Cerâmico SMD)
C95  Valor: 1u  [0402-cap]  (hidden comment: Capacitor Cerâmico SMD)
C96  Valor: 1u  [0402-cap]  (hidden comment: Capacitor Cerâmico SMD)
C97  Valor: 1u  [0402-cap]  (hidden comment: Capacitor Cerâmico SMD)
C98  Valor: 1u  [0402-cap]  (hidden comment: Capacitor Cerâmico SMD)
C99  Valor: 1u  [0402-cap]  (hidden comment: Capacitor Cerâmico SMD)
C100  Valor: 1u  [0402-cap]  (hidden comment: Capacitor Cerâmico SMD)
C101  Valor: 100n  [0402-cap]  (hidden comment: Capacitor Cerâmico SMD)
C102  Valor: 100n  [0402-cap]  (hidden comment: Capacitor Cerâmico SMD)
C103  Valor: 100n  [0402-cap]  (hidden comment: Capacitor Cerâmico SMD)
C104  Valor: 100n  [0402-cap]  (hidden comment: Capacitor Cerâmico SMD)
C105  Valor: 1u  [0402-cap]  (hidden comment: Capacitor Cerâmico SMD)
C106  Valor: 1u  [0402-cap]  (hidden comment: Capacitor Cerâmico SMD)
C107  Valor: 1u  [0402-cap]  (hidden comment: Capacitor Cerâmico SMD)
C108  Valor: 1u  [0402-cap]  (hidden comment: Capacitor Cerâmico SMD)
C109  Valor: 100n  [0402-cap]  (hidden comment: Capacitor Cerâmico SMD)
C110  Valor: 100n  [0402-cap]  (hidden comment: Capacitor Cerâmico SMD)
C111  Valor: 100n  [0402-cap]  (hidden comment: Capacitor Cerâmico SMD)
C112  Valor: 100n  [0402-cap]  (hidden comment: Capacitor Cerâmico SMD)
C113  Valor: 1u  [0402-cap]  (hidden comment: Capacitor Cerâmico SMD)
C114  Valor: 1u  [0402-cap]  (hidden comment: Capacitor Cerâmico SMD)
C115  Valor: 1u  [0402-cap]  (hidden comment: Capacitor Cerâmico SMD)
C116  Valor: 1u  [0402-cap]  (hidden comment: Capacitor Cerâmico SMD)
C117  Valor: 100n  [0402-cap]  (hidden comment: Capacitor Cerâmico SMD)
C118  Valor: 100n  [0402-cap]  (hidden comment: Capacitor Cerâmico SMD)
C119  Valor: 100n  [0402-cap]  (hidden comment: Capacitor Cerâmico SMD)
C120  Valor: 100n  [0402-cap]  (hidden comment: Capacitor Cerâmico SMD)
C121  Valor: 100n  [0402-cap]  (hidden comment: Capacitor Cerâmico SMD)
C122  Valor: 100n  [0402-cap]  (hidden comment: Capacitor Cerâmico SMD)
C123  Valor: 100n  [0402-cap]  (hidden comment: Capacitor Cerâmico SMD)
C124  Valor: 100n  [0402-cap]  (hidden comment: Capacitor Cerâmico SMD)
C125  Valor: 1u  [0402-cap]  (hidden comment: Capacitor Cerâmico SMD)
C126  Valor: 1u  [0402-cap]  (hidden comment: Capacitor Cerâmico SMD)
C127  Valor: 1u  [0402-cap]  (hidden comment: Capacitor Cerâmico SMD)
C128  Valor: 1u  [0402-cap]  (hidden comment: Capacitor Cerâmico SMD)
CN9  MHDR1X11  [MHDR1X11_Axonn]  (value not drawn)
CN10  MHDR1X11  [MHDR1X11_Axonn]  (value not drawn)
CN11  MHDR1X11  [MHDR1X11_Axonn]  (value not drawn)
CN12  MHDR1X11  [MHDR1X11_Axonn]  (value not drawn)
CN13  MHDR1X11  [MHDR1X11_Axonn]  (value not drawn)
CN14  MHDR1X11  [MHDR1X11_Axonn]  (value not drawn)
CN15  MHDR1X11  [MHDR1X11_Axonn]  (value not drawn)
CN16  MHDR1X11  [MHDR1X11_Axonn]  (value not drawn)
R33  Valor: 100R  [0402-res]  (hidden comment: Res3)
R34  Valor: 100R  [0402-res]  (hidden comment: Res3)
R35  Valor: 100R  [0402-res]  (hidden comment: Res3)
R36  Valor: 100R  [0402-res]  (hidden comment: Res3)
R37  Valor: 100R  [0402-res]  (hidden comment: Res3)
R38  Valor: 100R  [0402-res]  (hidden comment: Res3)
R39  Valor: 100R  [0402-res]  (hidden comment: Res3)
R40  Valor: 100R  [0402-res]  (hidden comment: Res3)
R41  Valor: 100R - NC  [0402-res]  (hidden comment: Res3)
R42  Valor: 100R - NC  [0402-res]  (hidden comment: Res3)
R43  Valor: 100R - NC  [0402-res]  (hidden comment: Res3)
R44  Valor: 100R - NC  [0402-res]  (hidden comment: Res3)
R45  Valor: 100R - NC  [0402-res]  (hidden comment: Res3)
R46  Valor: 100R - NC  [0402-res]  (hidden comment: Res3)
R47  Valor: 100R - NC  [0402-res]  (hidden comment: Res3)
R48  Valor: 100R - NC  [0402-res]  (hidden comment: Res3)
R49  Valor: 100R  [0402-res]  (hidden comment: Res3)
R50  Valor: 100R  [0402-res]  (hidden comment: Res3)
R51  Valor: 100R  [0402-res]  (hidden comment: Res3)
R52  Valor: 100R  [0402-res]  (hidden comment: Res3)
R53  Valor: 100R  [0402-res]  (hidden comment: Res3)
R54  Valor: 100R  [0402-res]  (hidden comment: Res3)
R55  Valor: 100R  [0402-res]  (hidden comment: Res3)
R56  Valor: 100R  [0402-res]  (hidden comment: Res3)
R57  Valor: 100R - NC  [0402-res]  (hidden comment: Res3)
R58  Valor: 100R - NC  [0402-res]  (hidden comment: Res3)
R59  Valor: 100R - NC  [0402-res]  (hidden comment: Res3)
R60  Valor: 100R - NC  [0402-res]  (hidden comment: Res3)
R61  Valor: 100R - NC  [0402-res]  (hidden comment: Res3)
R62  Valor: 100R - NC  [0402-res]  (hidden comment: Res3)
R63  Valor: 100R - NC  [0402-res]  (hidden comment: Res3)
R64  Valor: 100R - NC  [0402-res]  (hidden comment: Res3)
U41  TPD2E009DRTR  [DRT3]
U42  TPD2E009DRTR  [DRT3]
U43  TPD2E009DRTR  [DRT3]
U44  TPD2E009DRTR  [DRT3]
U45  TPD2E009DRTR  [DRT3]
U46  TPD2E009DRTR  [DRT3]
U47  TPD2E009DRTR  [DRT3]
U48  TPD2E009DRTR  [DRT3]
U49  ADN4650BRSZ  [SSOP-RS-20]
U50  ADN4650BRSZ  [SSOP-RS-20]
U51  ADN4650BRSZ  [SSOP-RS-20]
U52  ADN4650BRSZ  [SSOP-RS-20]
U53  TPD2E009DRTR  [DRT3]
U54  TPD2E009DRTR  [DRT3]
U55  TPD2E009DRTR  [DRT3]
U56  TPD2E009DRTR  [DRT3]
U57  TPD2E009DRTR  [DRT3]
U58  TPD2E009DRTR  [DRT3]
U59  TPD2E009DRTR  [DRT3]
U60  TPD2E009DRTR  [DRT3]
U61  TPD2E009DRTR  [DRT3]
U62  TPD2E009DRTR  [DRT3]
U63  TPD2E009DRTR  [DRT3]
U64  TPD2E009DRTR  [DRT3]
U65  TPD2E009DRTR  [DRT3]
U66  TPD2E009DRTR  [DRT3]
U67  TPD2E009DRTR  [DRT3]
U68  TPD2E009DRTR  [DRT3]
U69  ADN4650BRSZ  [SSOP-RS-20]
U70  ADN4650BRSZ  [SSOP-RS-20]
U71  ADN4650BRSZ  [SSOP-RS-20]
U72  ADN4650BRSZ  [SSOP-RS-20]
U73  TPD2E009DRTR  [DRT3]
U74  TPD2E009DRTR  [DRT3]
U75  TPD2E009DRTR  [DRT3]
U76  TPD2E009DRTR  [DRT3]
U77  TPD2E009DRTR  [DRT3]
U78  TPD2E009DRTR  [DRT3]
U79  TPD2E009DRTR  [DRT3]
U80  TPD2E009DRTR  [DRT3]

### Nets
+3V3_RX: C81.2 C82.2 C83.2 C84.2 C113.2 C114.2 C115.2 C116.2 U49.20(VIN2) U50.20(VIN2) U51.20(VIN2) U52.20(VIN2) U69.20(VIN2) U70.20(VIN2) U71.20(VIN2) U72.20(VIN2)
+3V3_RX_ISO: C73.1 C74.1 C75.1 C76.1 C105.1 C106.1 C107.1 C108.1 U49.1(VIN1) U50.1(VIN1) U51.1(VIN1) U52.1(VIN1) U69.1(VIN1) U70.1(VIN1) U71.1(VIN1) U72.1(VIN1)
GND: C81.1 C82.1 C83.1 C84.1 C85.1 C86.1 C87.1 C88.1 C89.1 C90.1 C91.1 C92.1 C93.1 C94.1 C95.1 C96.1 C113.1 C114.1 C115.1 C116.1 C117.1 C118.1 C119.1 C120.1 C121.1 C122.1 C123.1 C124.1 C125.1 C126.1 C127.1 C128.1 CN11.6 CN11.11 CN12.6 CN12.11 CN15.6 CN15.11 CN16.6 CN16.11 U49.11(GND2) U49.17(GND2) U49.19(GND2) U50.11(GND2) U50.17(GND2) U50.19(GND2) U51.11(GND2) U51.17(GND2) U51.19(GND2) U52.11(GND2) U52.17(GND2) U52.19(GND2) U53.3(GND) U54.3(GND) U55.3(GND) U56.3(GND) U57.3(GND) U58.3(GND) U59.3(GND) U60.3(GND) U69.11(GND2) U69.17(GND2) U69.19(GND2) U70.11(GND2) U70.17(GND2) U70.19(GND2) U71.11(GND2) U71.17(GND2) U71.19(GND2) U72.11(GND2) U72.17(GND2) U72.19(GND2) U73.3(GND) U74.3(GND) U75.3(GND) U76.3(GND) U77.3(GND) U78.3(GND) U79.3(GND) U80.3(GND)
GND_ISO: C65.1 C66.1 C67.1 C68.1 C69.1 C70.1 C71.1 C72.1 C73.2 C74.2 C75.2 C76.2 C77.1 C78.1 C79.1 C80.1 C97.1 C98.1 C99.1 C100.1 C101.1 C102.1 C103.1 C104.1 C105.2 C106.2 C107.2 C108.2 C109.1 C110.1 C111.1 C112.1 CN9.6 CN9.11 CN10.6 CN10.11 CN13.6 CN13.11 CN14.6 CN14.11 U41.3(GND) U42.3(GND) U43.3(GND) U44.3(GND) U45.3(GND) U46.3(GND) U47.3(GND) U48.3(GND) U49.2(GND1) U49.4(GND1) U49.10(GND1) U50.2(GND1) U50.4(GND1) U50.10(GND1) U51.2(GND1) U51.4(GND1) U51.10(GND1) U52.2(GND1) U52.4(GND1) U52.10(GND1) U61.3(GND) U62.3(GND) U63.3(GND) U64.3(GND) U65.3(GND) U66.3(GND) U67.3(GND) U68.3(GND) U69.2(GND1) U69.4(GND1) U69.10(GND1) U70.2(GND1) U70.4(GND1) U70.10(GND1) U71.2(GND1) U71.4(GND1) U71.10(GND1) U72.2(GND1) U72.4(GND1) U72.10(GND1)
RX1_ISO_N: CN9.2 R33.1 U41.2(D-) U49.6(DIN1-)
RX1_ISO_P: CN9.1 R33.2 U41.1(D+) U49.5(DIN1+)
RX1_N: CN11.2 R41.1 U49.15(DOUT1-) U53.1(D+)
RX1_P: CN11.1 R41.2 U49.16(DOUT1+) U53.2(D-)
RX2_ISO_N: CN9.4 R34.1 U42.2(D-) U49.8(DIN2-)
RX2_ISO_P: CN9.3 R34.2 U42.1(D+) U49.7(DIN2+)
RX2_N: CN11.4 R42.1 U49.13(DOUT2-) U54.1(D+)
RX2_P: CN11.3 R42.2 U49.14(DOUT2+) U54.2(D-)
RX3_ISO_N: CN9.8 R35.1 U43.2(D-) U50.6(DIN1-)
RX3_ISO_P: CN9.7 R35.2 U43.1(D+) U50.5(DIN1+)
RX3_N: CN11.8 R43.1 U50.15(DOUT1-) U55.1(D+)
RX3_P: CN11.7 R43.2 U50.16(DOUT1+) U55.2(D-)
RX4_ISO_N: CN9.10 R36.1 U44.2(D-) U50.8(DIN2-)
RX4_ISO_P: CN9.9 R36.2 U44.1(D+) U50.7(DIN2+)
RX4_N: CN11.10 R44.1 U50.13(DOUT2-) U56.1(D+)
RX4_P: CN11.9 R44.2 U50.14(DOUT2+) U56.2(D-)
RX5_ISO_N: CN10.2 R37.1 U45.2(D-) U51.6(DIN1-)
RX5_ISO_P: CN10.1 R37.2 U45.1(D+) U51.5(DIN1+)
RX5_N: CN12.2 R45.1 U51.15(DOUT1-) U57.1(D+)
RX5_P: CN12.1 R45.2 U51.16(DOUT1+) U57.2(D-)
RX6_ISO_N: CN10.4 R38.1 U46.2(D-) U51.8(DIN2-)
RX6_ISO_P: CN10.3 R38.2 U46.1(D+) U51.7(DIN2+)
RX6_N: CN12.4 R46.1 U51.13(DOUT2-) U58.1(D+)
RX6_P: CN12.3 R46.2 U51.14(DOUT2+) U58.2(D-)
RX7_ISO_N: CN10.8 R39.1 U47.2(D-) U52.6(DIN1-)
RX7_ISO_P: CN10.7 R39.2 U47.1(D+) U52.5(DIN1+)
RX7_N: CN12.8 R47.1 U52.15(DOUT1-) U59.1(D+)
RX7_P: CN12.7 R47.2 U52.16(DOUT1+) U59.2(D-)
RX8_ISO_N: CN10.10 R40.1 U48.2(D-) U52.8(DIN2-)
RX8_ISO_P: CN10.9 R40.2 U48.1(D+) U52.7(DIN2+)
RX8_N: CN12.10 R48.1 U52.13(DOUT2-) U60.1(D+)
RX8_P: CN12.9 R48.2 U52.14(DOUT2+) U60.2(D-)
RX9_ISO_N: CN13.2 R49.1 U61.2(D-) U69.6(DIN1-)
RX9_ISO_P: CN13.1 R49.2 U61.1(D+) U69.5(DIN1+)
RX9_N: CN15.2 R57.1 U69.15(DOUT1-) U73.1(D+)
RX9_P: CN15.1 R57.2 U69.16(DOUT1+) U73.2(D-)
RX10_ISO_N: CN13.4 R50.1 U62.2(D-) U69.8(DIN2-)
RX10_ISO_P: CN13.3 R50.2 U62.1(D+) U69.7(DIN2+)
RX10_N: CN15.4 R58.1 U69.13(DOUT2-) U74.1(D+)
RX10_P: CN15.3 R58.2 U69.14(DOUT2+) U74.2(D-)
RX11_ISO_N: CN13.8 R51.1 U63.2(D-) U70.6(DIN1-)
RX11_ISO_P: CN13.7 R51.2 U63.1(D+) U70.5(DIN1+)
RX11_N: CN15.8 R59.1 U70.15(DOUT1-) U75.1(D+)
RX11_P: CN15.7 R59.2 U70.16(DOUT1+) U75.2(D-)
RX12_ISO_N: CN13.10 R52.1 U64.2(D-) U70.8(DIN2-)
RX12_ISO_P: CN13.9 R52.2 U64.1(D+) U70.7(DIN2+)
RX12_N: CN15.10 R60.1 U70.13(DOUT2-) U76.1(D+)
RX12_P: CN15.9 R60.2 U70.14(DOUT2+) U76.2(D-)
RX13_ISO_N: CN14.2 R53.1 U65.2(D-) U71.6(DIN1-)
RX13_ISO_P: CN14.1 R53.2 U65.1(D+) U71.5(DIN1+)
RX13_N: CN16.2 R61.1 U71.15(DOUT1-) U77.1(D+)
RX13_P: CN16.1 R61.2 U71.16(DOUT1+) U77.2(D-)
RX14_ISO_N: CN14.4 R54.1 U66.2(D-) U71.8(DIN2-)
RX14_ISO_P: CN14.3 R54.2 U66.1(D+) U71.7(DIN2+)
RX14_N: CN16.4 R62.1 U71.13(DOUT2-) U78.1(D+)
RX14_P: CN16.3 R62.2 U71.14(DOUT2+) U78.2(D-)
RX15_ISO_N: CN14.8 R55.1 U67.2(D-) U72.6(DIN1-)
RX15_ISO_P: CN14.7 R55.2 U67.1(D+) U72.5(DIN1+)
RX15_N: CN16.8 R63.1 U72.15(DOUT1-) U79.1(D+)
RX15_P: CN16.7 R63.2 U72.16(DOUT1+) U79.2(D-)
RX16_ISO_N: CN14.10 R56.1 U68.2(D-) U72.8(DIN2-)
RX16_ISO_P: CN14.9 R56.2 U68.1(D+) U72.7(DIN2+)
RX16_N: CN16.10 R64.1 U72.13(DOUT2-) U80.1(D+)
RX16_P: CN16.9 R64.2 U72.14(DOUT2+) U80.2(D-)
NetC65_2: C65.2 C69.2 C77.2 U49.3(VDD1) U49.9(VDD1)
NetC66_2: C66.2 C70.2 C78.2 U50.3(VDD1) U50.9(VDD1)
NetC67_2: C67.2 C71.2 C79.2 U51.3(VDD1) U51.9(VDD1)
NetC68_2: C68.2 C72.2 C80.2 U52.3(VDD1) U52.9(VDD1)
NetC85_2: C85.2 C89.2 C93.2 U49.12(VDD2) U49.18(VDD2)
NetC86_2: C86.2 C90.2 C94.2 U50.12(VDD2) U50.18(VDD2)
NetC87_2: C87.2 C91.2 C95.2 U51.12(VDD2) U51.18(VDD2)
NetC88_2: C88.2 C92.2 C96.2 U52.12(VDD2) U52.18(VDD2)
NetC97_2: C97.2 C101.2 C109.2 U69.3(VDD1) U69.9(VDD1)
NetC98_2: C98.2 C102.2 C110.2 U70.3(VDD1) U70.9(VDD1)
NetC99_2: C99.2 C103.2 C111.2 U71.3(VDD1) U71.9(VDD1)
NetC100_2: C100.2 C104.2 C112.2 U72.3(VDD1) U72.9(VDD1)
NetC117_2: C117.2 C121.2 C125.2 U69.12(VDD2) U69.18(VDD2)
NetC118_2: C118.2 C122.2 C126.2 U70.12(VDD2) U70.18(VDD2)
NetC119_2: C119.2 C123.2 C127.2 U71.12(VDD2) U71.18(VDD2)
NetC120_2: C120.2 C124.2 C128.2 U72.12(VDD2) U72.18(VDD2)

Not connected (* = marked no-connect by the designer): CN9 5; CN10 5; CN11 5; CN12 5; CN13 5; CN14 5; CN15 5; CN16 5

### Layout directives
differential pair; net class RX1_RX4_ISO; rule Differential Pairs Routing [Pref Gap = 10mil    Min Gap  = 10mil    Max Gap  = 10milPref Width = 10mil    Min Width  = 10mil    Max Width  = 10mil]: RX1_ISO_N, RX1_ISO_P, RX2_ISO_N, RX2_ISO_P, RX3_ISO_N, RX3_ISO_P, RX4_ISO_N, RX4_ISO_P
differential pair; net class RX5_RX8_ISO; rule Differential Pairs Routing [Pref Gap = 10mil    Min Gap  = 10mil    Max Gap  = 10milPref Width = 10mil    Min Width  = 10mil    Max Width  = 10mil]: RX5_ISO_N, RX5_ISO_P, RX6_ISO_N, RX6_ISO_P, RX7_ISO_N, RX7_ISO_P, RX8_ISO_N, RX8_ISO_P
differential pair; net class RX1_RX4; rule Differential Pairs Routing [Pref Gap = 10mil    Min Gap  = 10mil    Max Gap  = 10milPref Width = 10mil    Min Width  = 10mil    Max Width  = 10mil]: RX1_N, RX1_P, RX2_N, RX2_P, RX3_N, RX3_P, RX4_N, RX4_P
differential pair; net class RX5_RX8; rule Differential Pairs Routing [Pref Gap = 10mil    Min Gap  = 10mil    Max Gap  = 10milPref Width = 10mil    Min Width  = 10mil    Max Width  = 10mil]: RX5_N, RX5_P, RX6_N, RX6_P, RX7_N, RX7_P, RX8_N, RX8_P
differential pair; net class RX9_RX12_ISO; rule Differential Pairs Routing [Pref Gap = 10mil    Min Gap  = 10mil    Max Gap  = 10milPref Width = 10mil    Min Width  = 10mil    Max Width  = 10mil]: RX9_ISO_N, RX9_ISO_P, RX10_ISO_N, RX10_ISO_P, RX11_ISO_N, RX11_ISO_P, RX12_ISO_N, RX12_ISO_P
differential pair; net class RX13_RX16_ISO; rule Differential Pairs Routing [Pref Gap = 10mil    Min Gap  = 10mil    Max Gap  = 10milPref Width = 10mil    Min Width  = 10mil    Max Width  = 10mil]: RX13_ISO_N, RX13_ISO_P, RX14_ISO_N, RX14_ISO_P, RX15_ISO_N, RX15_ISO_P, RX16_ISO_N, RX16_ISO_P
differential pair; net class RX9_RX12; rule Differential Pairs Routing [Pref Gap = 10mil    Min Gap  = 10mil    Max Gap  = 10milPref Width = 10mil    Min Width  = 10mil    Max Width  = 10mil]: RX9_N, RX9_P, RX10_N, RX10_P, RX11_N, RX11_P, RX12_N, RX12_P
differential pair; net class RX13_RX16; rule Differential Pairs Routing [Pref Gap = 10mil    Min Gap  = 10mil    Max Gap  = 10milPref Width = 10mil    Min Width  = 10mil    Max Width  = 10mil]: RX13_N, RX13_P, RX14_N, RX14_P, RX15_N, RX15_P, RX16_N, RX16_P

### Notes on the sheet
- 3750 Vrms - 600 Mbps
- ISOLATED EXTERNAL SpW LVDS RX DRIVERS
- Header - top side
- 1.27 mm - with lock
- Housing - bottom side
- Board to Board
- 1.27 mm - without lock
- (near CN11) Rx out (to drivers_lvds rx in)
- (near CN15) Rx out (to drivers_lvds rx in)
- (near CN9) Rx in (from SpW cable)
- Rx in (from SpW cable)
- Pin 3
- (near C93) Pin 18
- (near C125) Pin 18
- (near C94) Pin 18
- (near C126) Pin 18
- (near CN12) Rx out (to drivers_lvds rx in)
- (near CN16) Rx out (to drivers_lvds rx in)
- (near CN10) Rx in (from SpW cable)
- (near CN14) Rx in (from SpW cable)
- (near C95) Pin 18
- (near C127) Pin 18
- (near C96) Pin 18
- (near C128) Pin 18
- All LVDS lines protected with Dual-Matching TVS Diodes TPD2E009

### Library data of the parts
CN9-CN16 = MHDR1X11: Header, 11-Pin; LatestRevisionDate: 17-Jul-2002; LatestRevisionNote: Re-released for DXP Platform.; Publisher: Altium Limited
R33-R64 = Res3: Resistor; Grupo: 01
U41-U48 U53-U68 U73-U80 = TPD2E009DRTR: as U1 on sheet iso_lvds_tx; DatasheetVersion: SLVS953A; PackageVersion: revD, Jun-2008; PackageReference: DRT3; PackageDescription: 3-Flat Lead Plastic Small Outline, 1 x 1 mm (inc leads), 0.35 mm Pitch; Supplier 1: Digi-Key; Supplier Part Number 1: 296-25410-2-ND; Supplier 2: Digi-Key; Supplier Part Number 2: 296-25410-1-ND; Supplier 3: Digi-Key; Supplier Part Number 3: 296-25410-6-ND; Supplier 4: Newark; Supplier Part Number 4: 50R8093; Supplier 5: Mouser; Supplier Part Number 5: 595-TPD2E009DRTR; Eco-Plan: Green (RoHS & no Sb/Br); IEC 61000-4-2 Contact(+/- kV): 8; Mounting Technology: Surface Mount; PartNumber: TPD2E009DRTR; ComponentLink1Description: Datasheet; ComponentLink1URL: http://www.ti.com/general/docs/lit/getliterature.tsp?genericPartNumber=TPD2E009&fileType=pdf; ComponentLink2Description: URL Link1; ComponentLink2URL: SamplesURL:http://www.ti.com/product/tpd2e009#samples
U49-U52 U69-U72 = ADN4650BRSZ: as U9 on sheet iso_lvds_tx; Valor: *; Obs: *; Datasheet: *; Part Number: ADN4650BRSZ

## Sheet iso_sincs.SchDoc: Iso Sinc in/out & gpio
size A4; Author: Cassio Berni; DrawnBy: CCB; Revision: 1_01; SheetNumber: 3; SheetTotal: 4
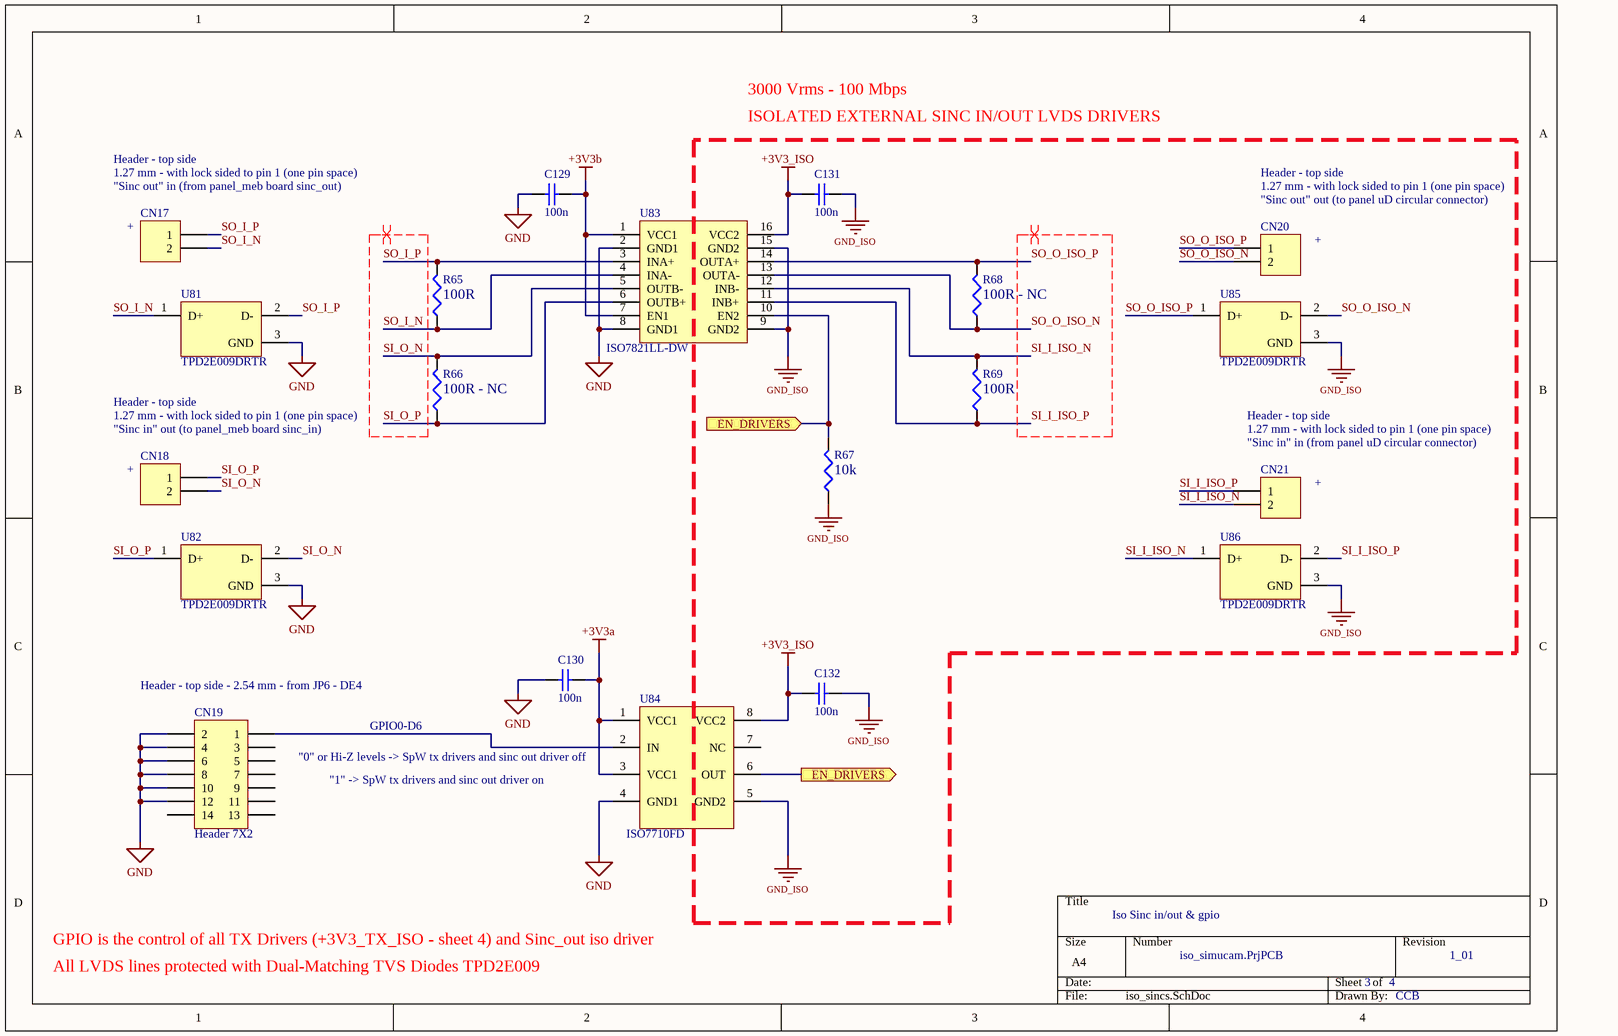
[diagram p4: iso_sincs.SchDoc]

### Parts
C129  Valor: 100n  [0402-cap]  (hidden comment: Capacitor Cerâmico SMD)
C130  Valor: 100n  [0402-cap]  (hidden comment: Capacitor Cerâmico SMD)
C131  Valor: 100n  [0402-cap]  (hidden comment: Capacitor Cerâmico SMD)
C132  Valor: 100n  [0402-cap]  (hidden comment: Capacitor Cerâmico SMD)
CN17  MHDR1X2  [MHDR1X2_AXONN]  (value not drawn)
CN18  MHDR1X2  [MHDR1X2_AXONN]  (value not drawn)
CN19  Header 7X2  [HDR2X7]
CN20  MHDR1X2  [MHDR1X2_AXONN]  (value not drawn)
CN21  MHDR1X2  [MHDR1X2_AXONN]  (value not drawn)
R65  Valor: 100R  [0402-res]  (hidden comment: Res3)
R66  Valor: 100R - NC  [0402-res]  (hidden comment: Res3)
R67  Valor: 10k  [0402-res]  (hidden comment: Res3)
R68  Valor: 100R - NC  [0402-res]  (hidden comment: Res3)
R69  Valor: 100R  [0402-res]  (hidden comment: Res3)
U81  TPD2E009DRTR  [DRT3]
U82  TPD2E009DRTR  [DRT3]
U83  ISO7821LL-DW  [SOIC-16-DW]
U84  ISO7710FD  [SOIC-8]
U85  TPD2E009DRTR  [DRT3]
U86  TPD2E009DRTR  [DRT3]

### Blocks framed on the sheet
ISOLATED EXTERNAL SINC IN/OUT LVDS DRIVERS: C131 C132 CN20 CN21 R67-R69 U83 U85 U86

### Ports
EN_DRIVERS (in), EN_DRIVERS (out)

### Nets
+3V3_ISO: C131.1 C132.2 U83.16(VCC2) U84.8(VCC2)
+3V3a: C130.1 U84.1(VCC1) U84.3(VCC1)
+3V3b: C129.2 U83.1(VCC1) U83.7(EN1)
GND: C129.1 C130.2 CN19.2 CN19.4 CN19.6 CN19.8 CN19.10 CN19.12 U81.3(GND) U82.3(GND) U83.2(GND1) U83.8(GND1) U84.4(GND1)
GND_ISO: C131.2 C132.1 R67.1 U83.9(GND2) U83.15(GND2) U84.5(GND2) U85.3(GND) U86.3(GND)
SI_I_ISO_N: CN21.2 R69.2 U83.12(INB-) U86.1(D+)
SI_I_ISO_P: CN21.1 R69.1 U83.11(INB+) U86.2(D-)
SI_O_N: CN18.2 R66.2 U82.2(D-) U83.5(OUTB-)
SI_O_P: CN18.1 R66.1 U82.1(D+) U83.6(OUTB+)
SO_I_N: CN17.2 R65.1 U81.1(D+) U83.4(INA-)
SO_I_P: CN17.1 R65.2 U81.2(D-) U83.3(INA+)
SO_O_ISO_N: CN20.2 R68.1 U83.13(OUTA-) U85.2(D-)
SO_O_ISO_P: CN20.1 R68.2 U83.14(OUTA+) U85.1(D+)
NetCN19_1: CN19.1 U84.2(IN)
NetR67_2: R67.2 U83.10(EN2) U84.6(OUT) ; port EN_DRIVERS

Not connected (* = marked no-connect by the designer): CN19 3 5 7 9 11 13 14; U84 7(NC)

### Layout directives
differential pair; net class SOI_SIO; rule Differential Pairs Routing [Pref Gap = 10mil    Min Gap  = 10mil    Max Gap  = 10milPref Width = 10mil    Min Width  = 10mil    Max Width  = 10mil]: SI_O_N, SI_O_P, SO_I_N, SO_I_P
differential pair; net class SOO_SII_ISO; rule Differential Pairs Routing [Pref Gap = 10mil    Min Gap  = 10mil    Max Gap  = 10milPref Width = 10mil    Min Width  = 10mil    Max Width  = 10mil]: SI_I_ISO_N, SI_I_ISO_P, SO_O_ISO_N, SO_O_ISO_P

### Notes on the sheet
- 3000 Vrms - 100 Mbps
- Header - top side
- 1.27 mm - with lock sided to pin 1 (one pin space)
- (near CN17) "Sinc out" in (from panel_meb board sinc_out)
- (near CN17) +
- (near CN20) "Sinc out" out (to panel uD circular connector)
- +
- (near R66) 1.27 mm - with lock sided to pin 1 (one pin space)
- (near CN18) "Sinc in" out (to panel_meb board sinc_in)
- (near CN21) "Sinc in" in (from panel uD circular connector)
- (near CN18) +
- (near CN19) Header - top side - 2.54 mm - from JP6 - DE4
- (near U84) "0" or Hi-Z levels -> SpW tx drivers and sinc out driver off
- (near U84) "1" -> SpW tx drivers and sinc out driver on
- GPIO0-D6
- All LVDS lines protected with Dual-Matching TVS Diodes TPD2E009
- GPIO is the control of all TX Drivers (+3V3_TX_ISO - sheet 4) and Sinc_out iso driver

### Library data of the parts
CN17 CN18 CN20 CN21 = MHDR1X2: Header, 2-Pin; Valor: Header 1.27 mm - 2 vias; LatestRevisionDate: 17-Jul-2002; LatestRevisionNote: Re-released for DXP Platform.; Publisher: Altium Limited
CN19 = Header 7X2: Header, 7-Pin, Dual row; LatestRevisionDate: 17-Jul-2002; LatestRevisionNote: Re-released for DXP Platform.; Publisher: Altium Limited
R65-R69 = Res3: Resistor; Grupo: 01
U81 U82 U85 U86 = TPD2E009DRTR: as U1 on sheet iso_lvds_tx; DatasheetVersion: SLVS953A; PackageVersion: revD, Jun-2008; PackageReference: DRT3; PackageDescription: 3-Flat Lead Plastic Small Outline, 1 x 1 mm (inc leads), 0.35 mm Pitch; Supplier 1: Digi-Key; Supplier Part Number 1: 296-25410-2-ND; Supplier 2: Digi-Key; Supplier Part Number 2: 296-25410-1-ND; Supplier 3: Digi-Key; Supplier Part Number 3: 296-25410-6-ND; Supplier 4: Newark; Supplier Part Number 4: 50R8093; Supplier 5: Mouser; Supplier Part Number 5: 595-TPD2E009DRTR; Eco-Plan: Green (RoHS & no Sb/Br); IEC 61000-4-2 Contact(+/- kV): 8; Mounting Technology: Surface Mount; PartNumber: TPD2E009DRTR; ComponentLink1Description: Datasheet; ComponentLink1URL: http://www.ti.com/general/docs/lit/getliterature.tsp?genericPartNumber=TPD2E009&fileType=pdf; ComponentLink2Description: URL Link1; ComponentLink2URL: SamplesURL:http://www.ti.com/product/tpd2e009#samples
U83 = ISO7821LL-DW: High-Performance, 8000-VPK Reinforced Isolated Dual-LVDS Buffer; Publisher: Altium Limited; ComponentLink1Description: Manufacturer Link; ComponentLink1URL: http://www.ti.com/; ComponentLink2Description: Datasheet
U84 = ISO7710FD: High Speed, Robust EMC Reinforced Single-Channel Digital Isolator; ComponentAvailability: Obsolete; LatestRevisionNote: Stylized 3D Model Added.; PackageReference: SOIC-8; Publisher: Altium Limited; PackageDescription: DFP; 8 Leads; Body 4.9 x 3.9 mm (LxW max); Pitch 1.27 mm; Code_JEDEC: MO-092-AA; ComponentLink1Description: Manufacturer Link; ComponentLink1URL: http://www.ti.com/; ComponentLink2Description: Datasheet